# EAGLE board M8300B (EAGLE 6.6.0), part 1 of 3
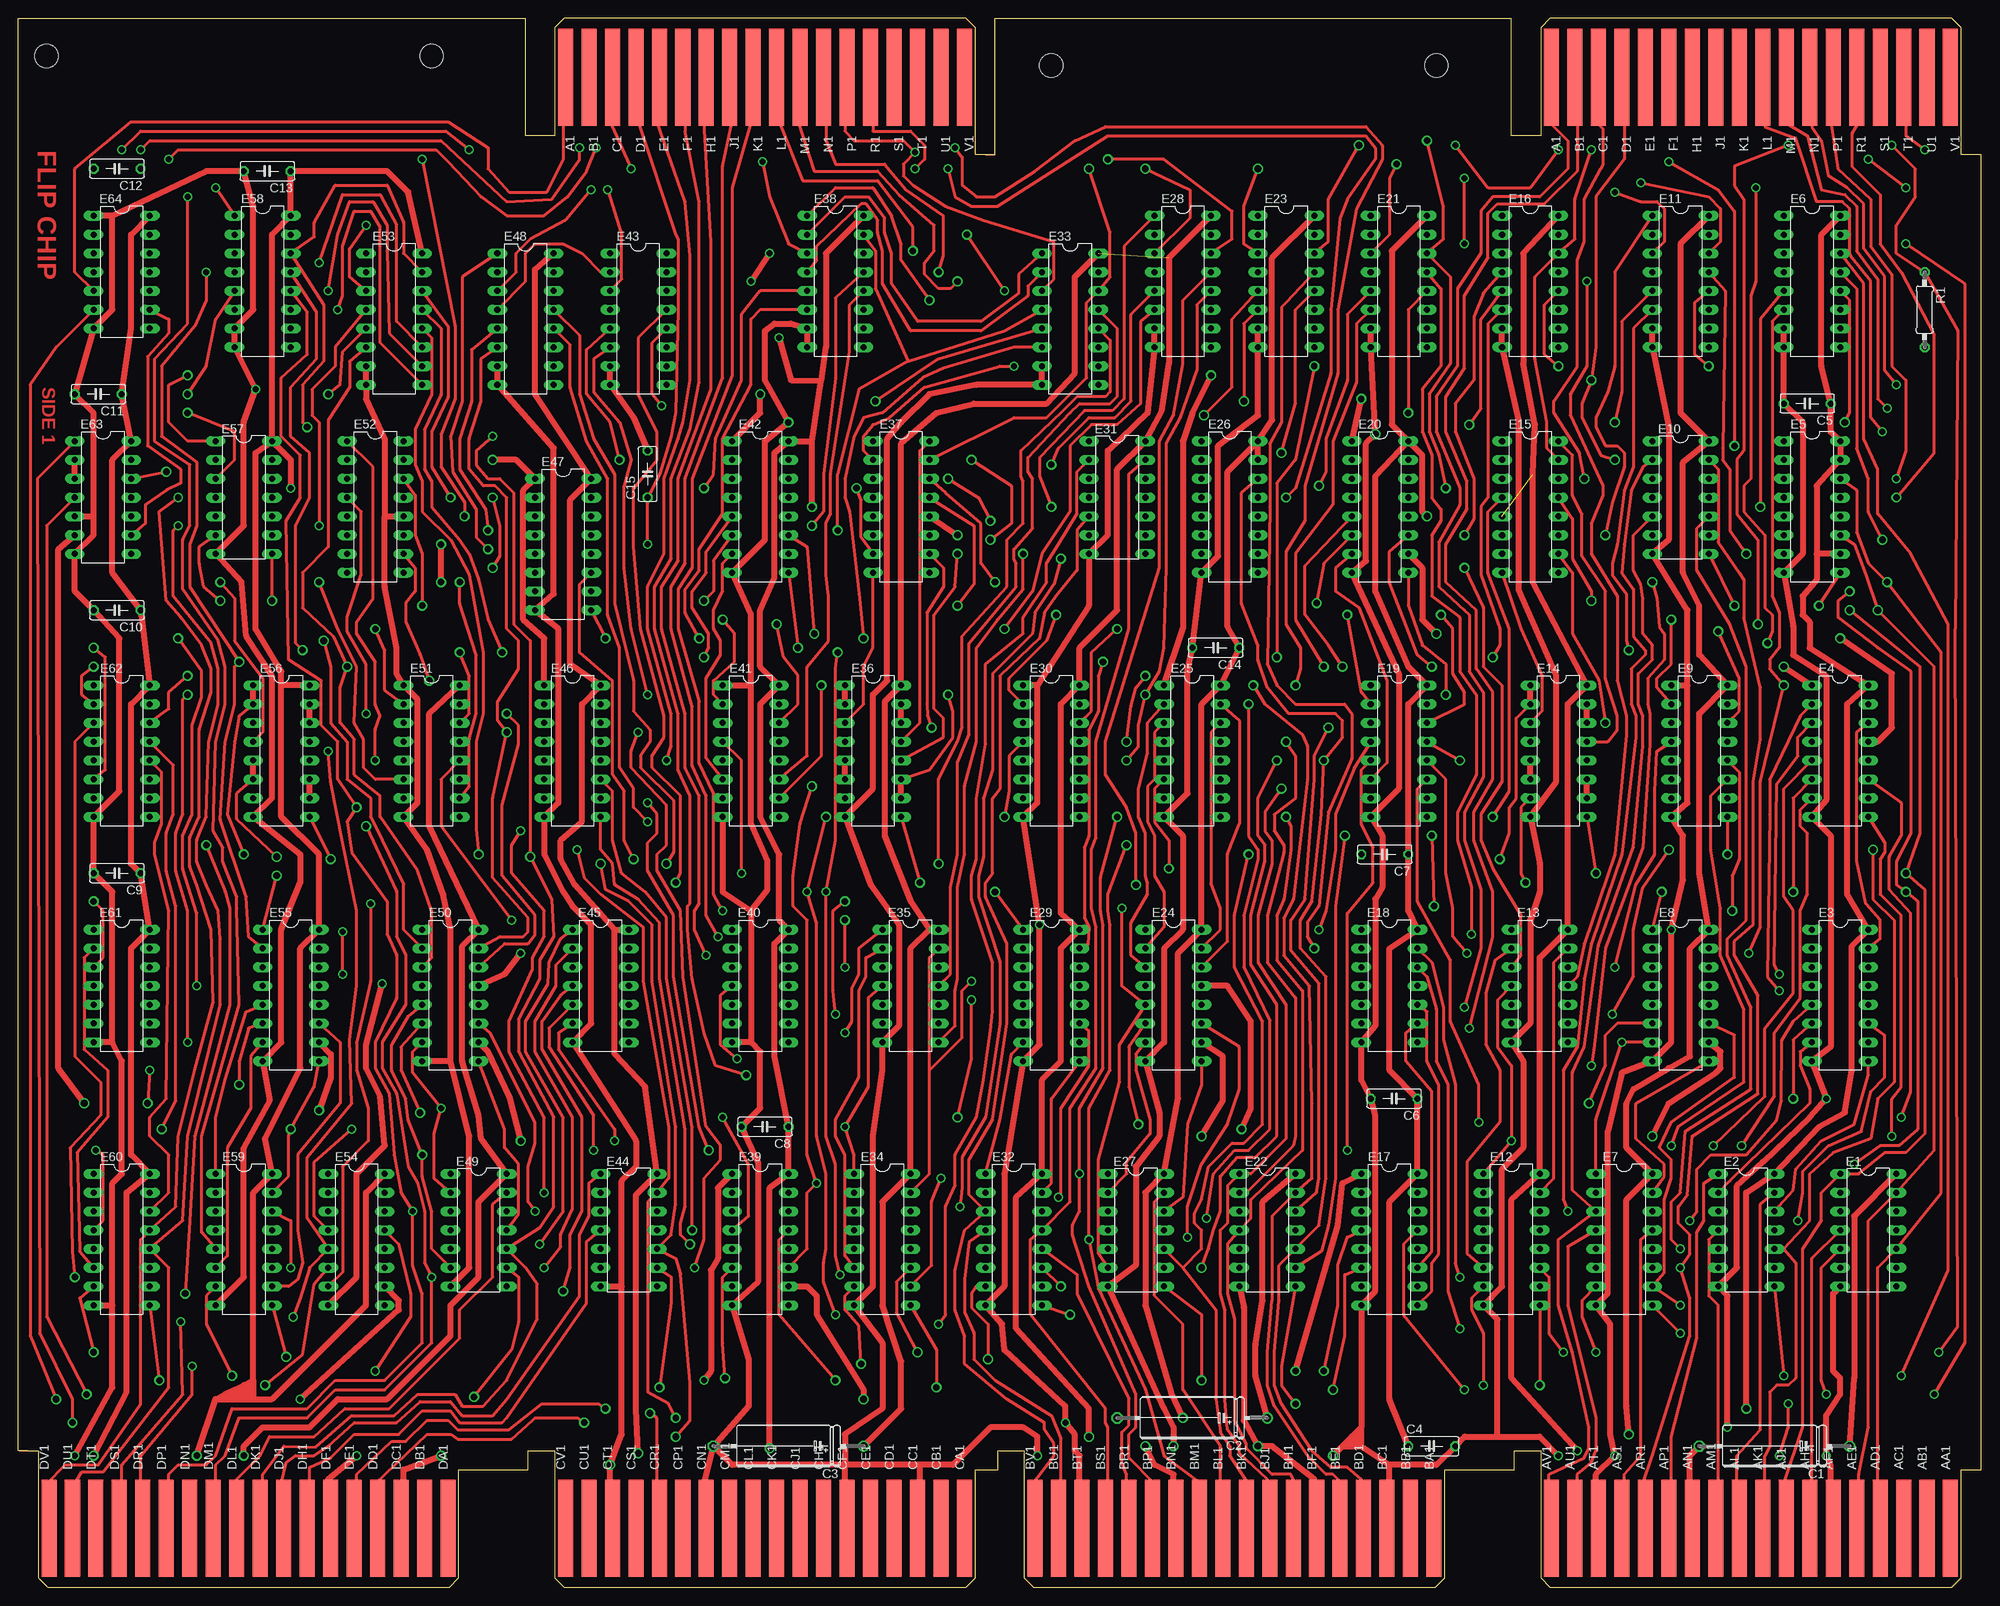
[diagram p3: board, top side]
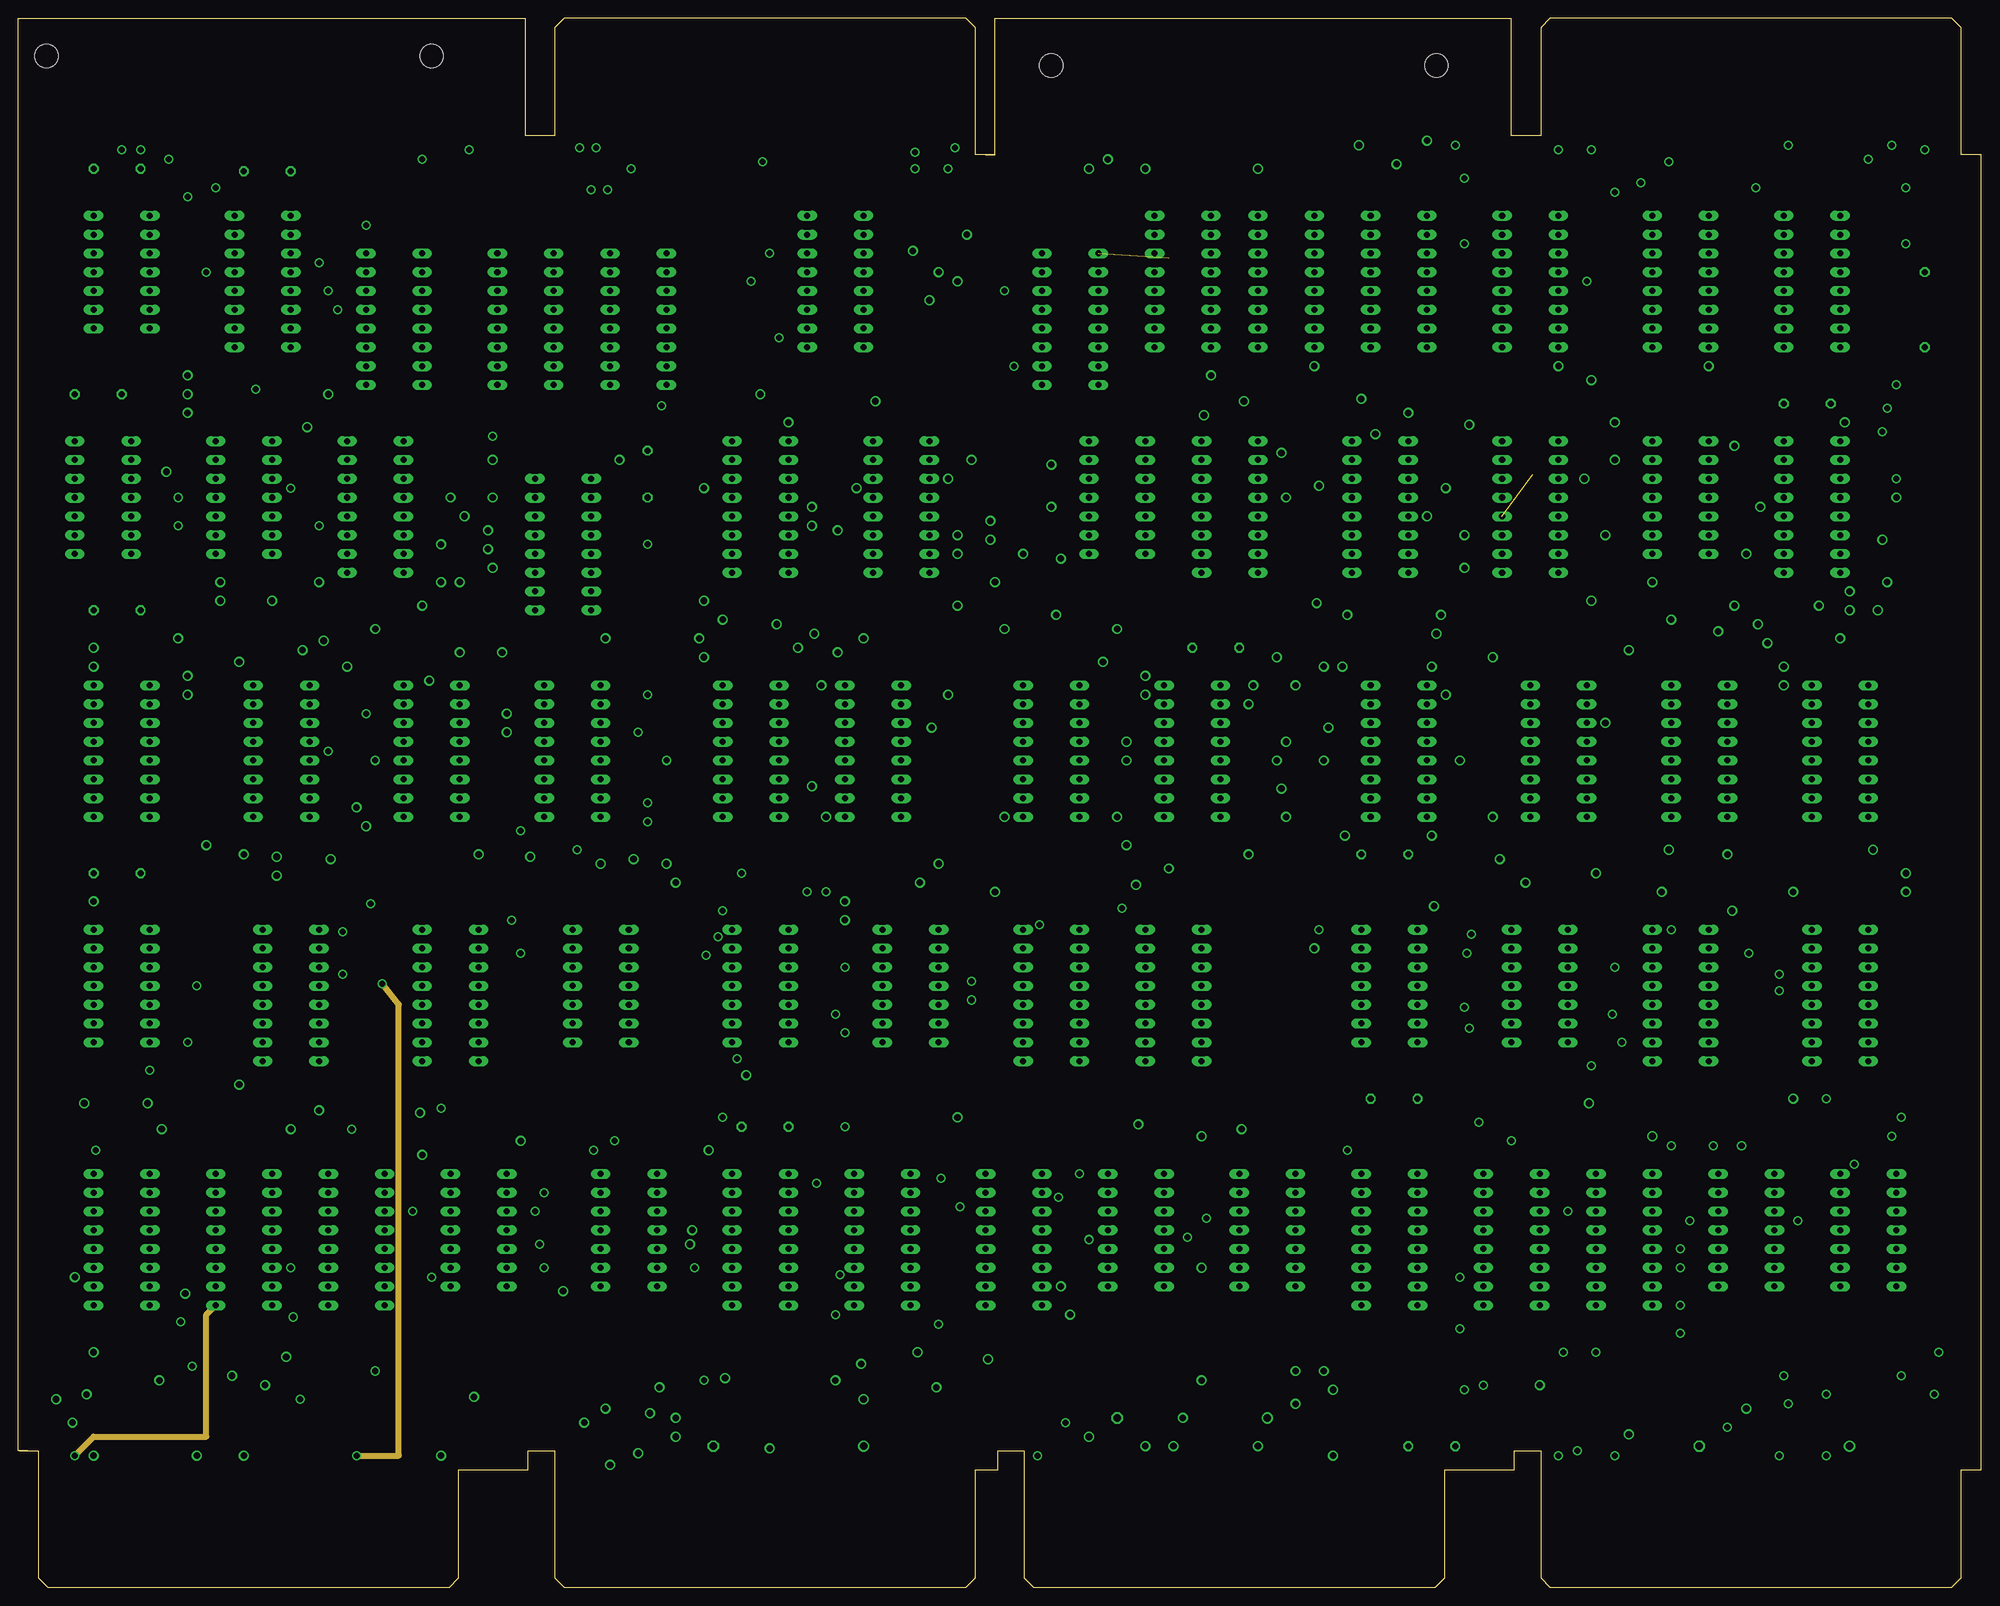
[diagram p4: board, inner layer Route2]
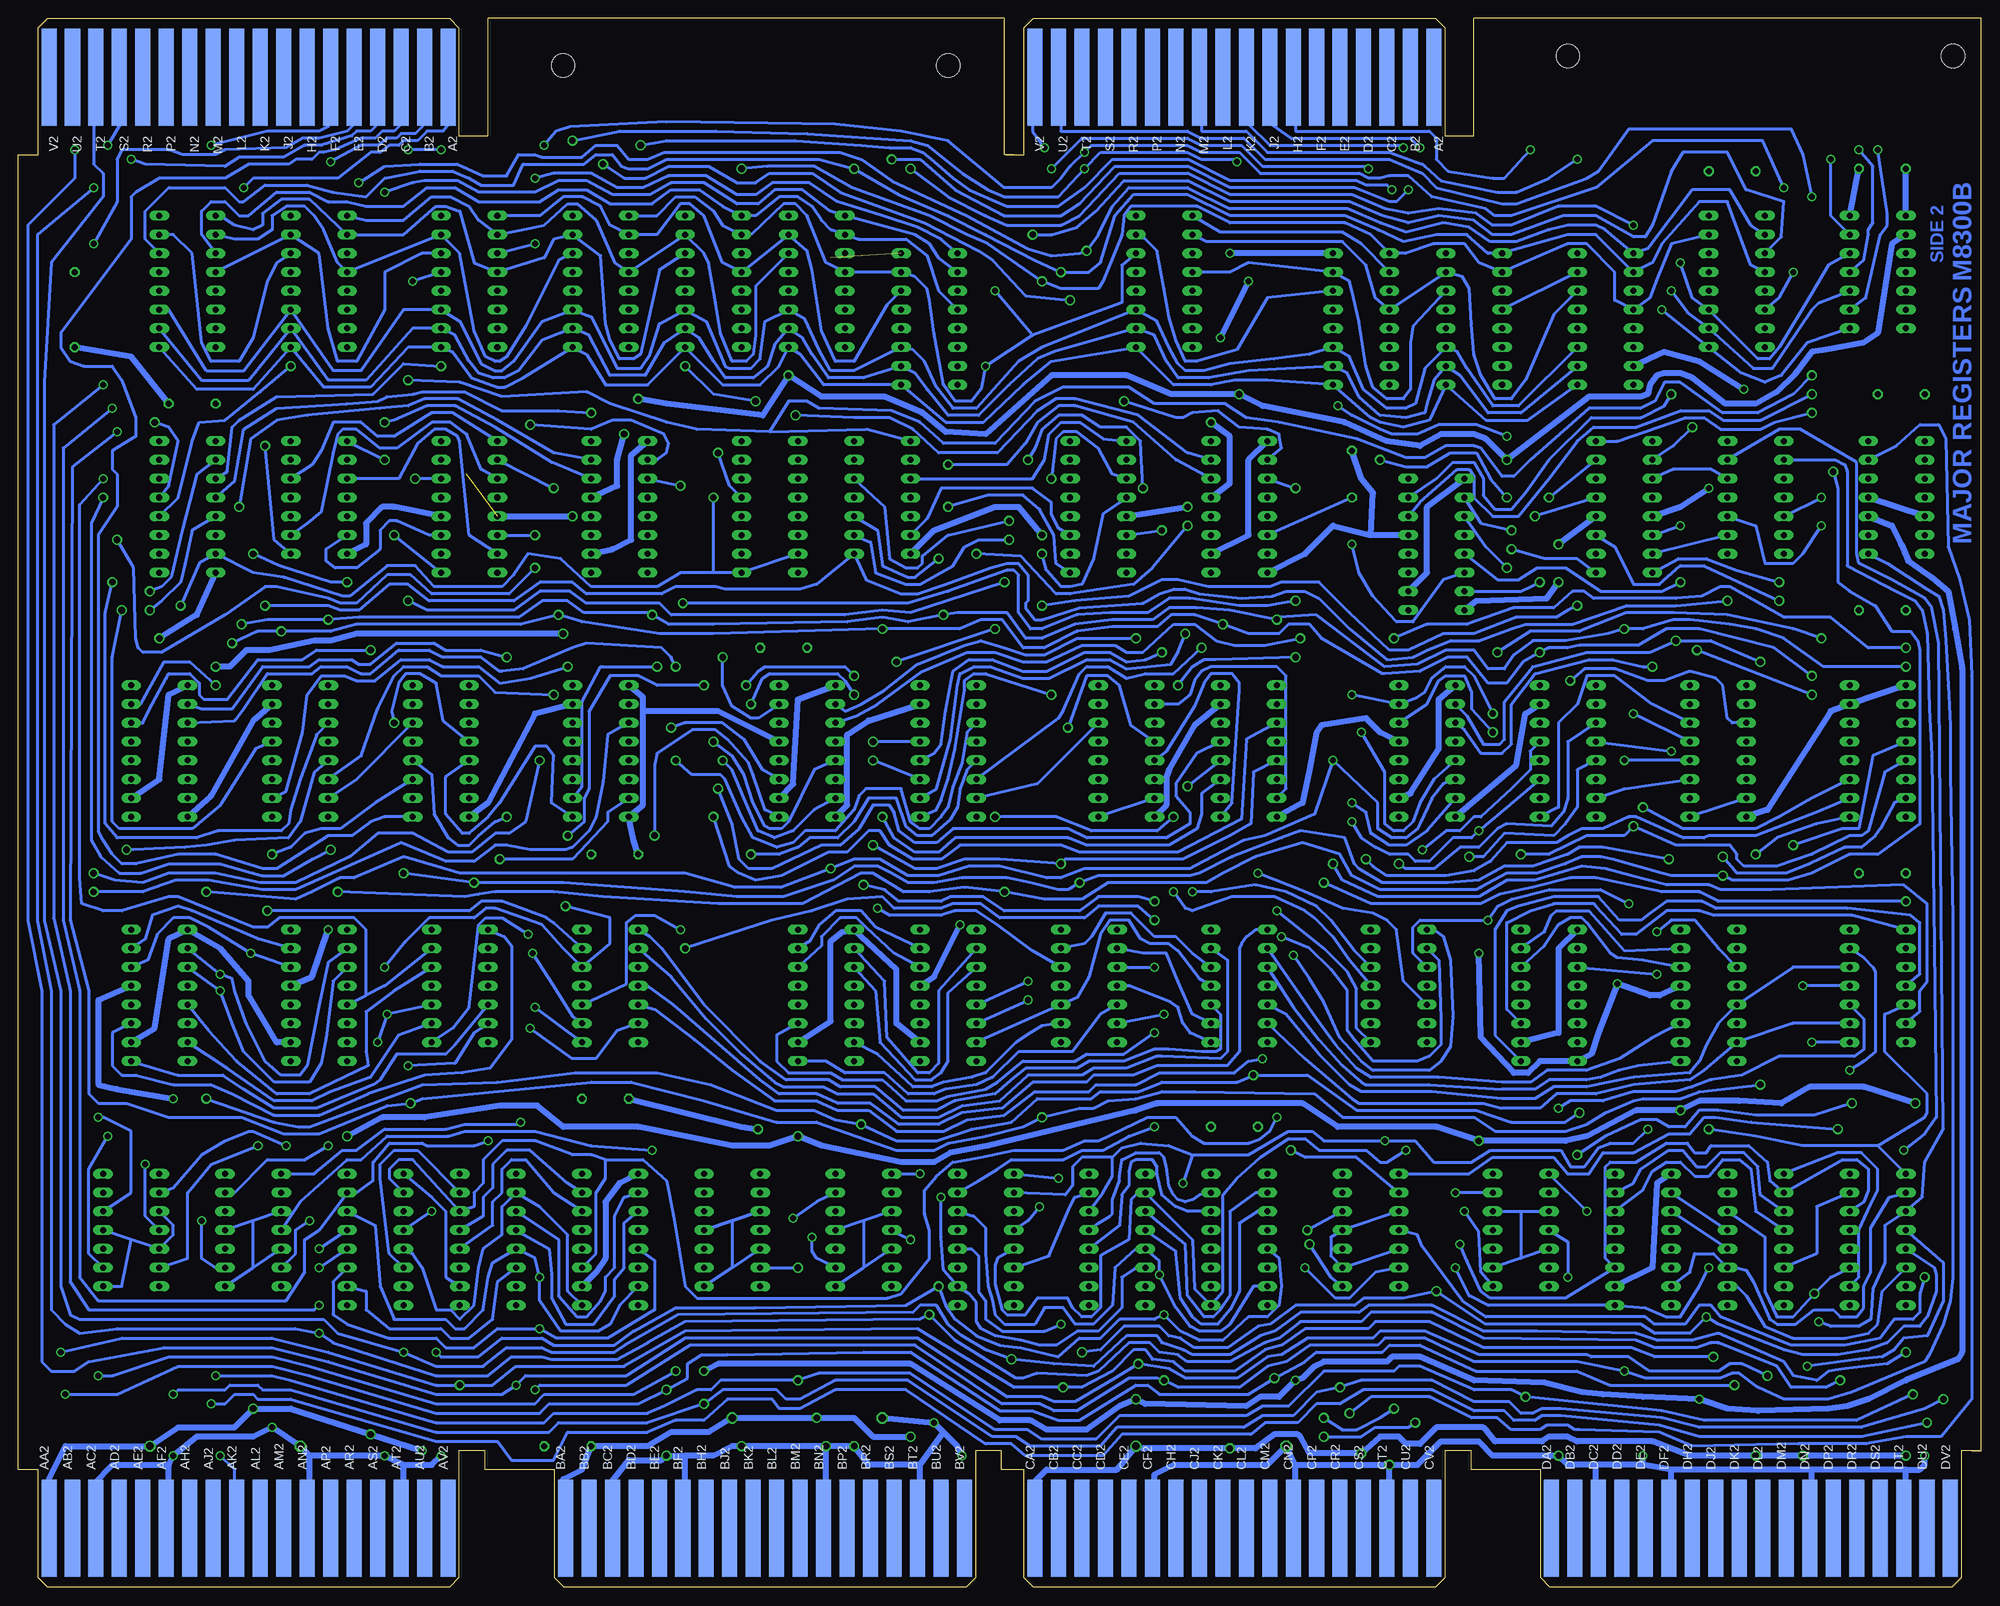
[diagram p5: board, bottom side, seen from below]

Size 265.43 x 212.09 mm. Coordinates in mm from the lower left corner, seen from the top.
Outline: 203.2,196.22 201.93,196.22 201.93,212.09 132.08,212.09 132.08,193.68 130.81,193.68
Outline: 1.27,18.41 0,18.41 0,212.09 68.58,212.09 68.58,196.22 69.85,196.22
Outline: 265.43,15.88 265.43,193.68 264.16,193.68
Copper layers (1+2+16): Top 0.035mm / dielectric 1.5mm / Route2 0.035mm / dielectric 0.15mm / Bottom 0.035mm
Design rules "16mils *": minimum track width 16mil, minimum drill 32mil, track to track 15mil, track to pad 10mil, pad to pad 10mil, via to via 10mil, smd to smd 10mil, copper to edge 13mil, drill to drill 10mil, minimum pad ring 10mil, minimum via ring 8mil, stop-mask expansion 0mil, vias tented up to drill 0mil, thermal gap 10mil
Net classes: 1 supply: width 0.813 mm
Holes 3.2 mm at 3.81,207.01 55.88,207.01 191.77,205.74 139.7,205.74

## Footprints (pad centres in the part's own frame; a part is rotated, then mirrored left to right if it is on the bottom)
E12-8 = drill 1.016: + -10.16,0 | drill 1.016 octagon: - 10.16,0
C063-025X075 = drill 0.813 octagon: 1 -2.54,0; 2 3.81,0
EDGE-CON2 = smd 13.106 x 2.032: A1 7.938,4.128; B1 7.938,7.303; C1 7.938,10.477; D1 7.938,13.652; E1 7.938,16.828; F1 7.938,20.003; H1 7.938,23.177; J1 7.938,26.352; K1 7.938,29.527; L1 7.938,32.703; M1 7.938,35.877; N1 7.938,39.053; P1 7.938,42.227; R1 7.938,45.403; S1 7.938,48.578; T1 7.938,51.752; U1 7.938,54.928; V1 7.938,58.102 | smd 13.106 x 2.032 bottom: A2 7.938,4.128; B2 7.938,7.303; C2 7.938,10.477; D2 7.938,13.652; E2 7.938,16.828; F2 7.938,20.003; H2 7.938,23.177; J2 7.938,26.352; K2 7.938,29.527; L2 7.938,32.703; M2 7.938,35.877; N2 7.938,39.053; P2 7.938,42.227; R2 7.938,45.403; S2 7.938,48.578; T2 7.938,51.752; U2 7.938,54.928; V2 7.938,58.102
DIL14 = drill 0.813 long: 1 -7.62,-3.81; 2 -5.08,-3.81; 3 -2.54,-3.81; 4 0,-3.81; 5 2.54,-3.81; 6 5.08,-3.81; 7 7.62,-3.81; 8 7.62,3.81; 9 5.08,3.81; 10 2.54,3.81; 11 0,3.81; 12 -2.54,3.81; 13 -5.08,3.81; 14 -7.62,3.81
DIL16 = drill 0.813 long: 1 -8.89,-3.81; 2 -6.35,-3.81; 3 -3.81,-3.81; 4 -1.27,-3.81; 5 1.27,-3.81; 6 3.81,-3.81; 7 6.35,-3.81; 8 8.89,-3.81; 9 8.89,3.81; 10 6.35,3.81; 11 3.81,3.81; 12 1.27,3.81; 13 -1.27,3.81; 14 -3.81,3.81; 15 -6.35,3.81; 16 -8.89,3.81
0207/10 = drill 0.813 octagon: 1 -5.08,0; 2 5.08,0
EDGE-CON8 = smd 2.032 x 13.106: AA1 261.303,7.938; AB1 258.127,7.938; AC1 254.952,7.938; AD1 251.778,7.938; AE1 248.602,7.938; AF1 245.428,7.938; AH1 242.252,7.938; AJ1 239.077,7.938; AK1 235.903,7.938; AL1 232.727,7.938; AM1 229.553,7.938; AN1 226.377,7.938; AP1 223.202,7.938; AR1 220.028,7.938; AS1 216.852,7.938; AT1 213.678,7.938; AU1 210.502,7.938; AV1 207.327,7.938; BA1 191.452,7.938; BB1 188.278,7.938; BC1 185.102,7.938; BD1 181.928,7.938; BE1 178.752,7.938; BF1 175.577,7.938; BH1 172.403,7.938; BJ1 169.227,7.938; BK1 166.053,7.938; BL1 162.877,7.938; BM1 159.702,7.938; BN1 156.528,7.938; BP1 153.352,7.938; BR1 150.178,7.938; BS1 147.002,7.938; BT1 143.827,7.938; BU1 140.653,7.938; BV1 137.477,7.938; CA1 127.953,7.938; CB1 124.778,7.938; CC1 121.603,7.938; CD1 118.427,7.938; CE1 115.252,7.938; CF1 112.078,7.938; CH1 108.903,7.938; CJ1 105.728,7.938; CK1 102.552,7.938; CL1 99.377,7.938; CM1 96.203,7.938; CN1 93.028,7.938; CP1 89.853,7.938; CR1 86.677,7.938; CS1 83.502,7.938; CT1 80.328,7.938; CU1 77.153,7.938; CV1 73.978,7.938; DA1 58.102,7.938; DB1 54.928,7.938; DC1 51.752,7.938; DD1 48.578,7.938; DE1 45.403,7.938; DF1 42.227,7.938; DH1 39.053,7.938; DJ1 35.877,7.938; DK1 32.703,7.938; DL1 29.527,7.938; DM1 26.352,7.938; DN1 23.177,7.938; DP1 20.003,7.938; DR1 16.828,7.938; DS1 13.652,7.938; DT1 10.477,7.938; DU1 7.303,7.938; DV1 4.128,7.938 | smd 2.032 x 13.106 bottom: AA2 261.303,7.938; AB2 258.127,7.938; AC2 254.952,7.938; AD2 251.778,7.938; AE2 248.602,7.938; AF2 245.428,7.938; AH2 242.252,7.938; AJ2 239.077,7.938; AK2 235.903,7.938; AL2 232.727,7.938; AM2 229.553,7.938; AN2 226.377,7.938; AP2 223.202,7.938; AR2 220.028,7.938; AS2 216.852,7.938; AT2 213.678,7.938; AU2 210.502,7.938; AV2 207.327,7.938; BA2 191.452,7.938; BB2 188.278,7.938; BC2 185.102,7.938; BD2 181.928,7.938; BE2 178.752,7.938; BF2 175.577,7.938; BH2 172.403,7.938; BJ2 169.227,7.938; BK2 166.053,7.938; BL2 162.877,7.938; BM2 159.702,7.938; BN2 156.528,7.938; BP2 153.352,7.938; BR2 150.178,7.938; BS2 147.002,7.938; BT2 143.827,7.938; BU2 140.653,7.938; BV2 137.477,7.938; CA2 127.953,7.938; CB2 124.778,7.938; CC2 121.603,7.938; CD2 118.427,7.938; CE2 115.252,7.938; CF2 112.078,7.938; CH2 108.903,7.938; CJ2 105.728,7.938; CK2 102.552,7.938; CL2 99.377,7.938; CM2 96.203,7.938; CN2 93.028,7.938; CP2 89.853,7.938; CR2 86.677,7.938; CS2 83.502,7.938; CT2 80.328,7.938; CU2 77.153,7.938; CV2 73.978,7.938; DA2 58.102,7.938; DB2 54.928,7.938; DC2 51.752,7.938; DD2 48.578,7.938; DE2 45.403,7.938; DF2 42.227,7.938; DH2 39.053,7.938; DJ2 35.877,7.938; DK2 32.703,7.938; DL2 29.527,7.938; DM2 26.352,7.938; DN2 23.177,7.938; DP2 20.003,7.938; DR2 16.828,7.938; DS2 13.652,7.938; DT2 10.477,7.938; DU2 7.303,7.938; DV2 4.128,7.938

## Placement (x,y rotation side)
C1  6.8uF  [E12-8]  237.49,19.05 180 top
C2  6.8uF  [E12-8]  158.75,22.86 180 top
C3  6.8uF  [E12-8]  104.14,19.05 180 top
C4  .22uF  [C063-025X075]  190.5,19.05 0 top
C5  .22uF  [C063-025X075]  242.57,160.02 180 top
C6  .22uF  [C063-025X075]  186.69,66.04 180 top
C7  .22uF  [C063-025X075]  185.42,99.06 180 top
C8  .22uF  [C063-025X075]  101.6,62.23 180 top
C9  .22uF  [C063-025X075]  13.97,96.52 180 top
C10  .22uF  [C063-025X075]  13.97,132.08 180 top
C11  .22uF  [C063-025X075]  11.43,161.29 180 top
C12  .22uF  [C063-025X075]  13.97,191.77 180 top
C13  .22uF  [C063-025X075]  34.29,191.45 180 top
C14  .22uF  [C063-025X075]  162.56,127 180 top
C15  100pF  [C063-025X075]  85.09,149.86 90 top
E  EDGE-TOP  [EDGE-CON2]  203.2,212.09 270 top
E1  N8881N  [DIL14]  250.19,48.26 270 top
E2  N8881N  [DIL14]  233.68,48.26 270 top
E3  DEC8271  [DIL16]  246.38,80.01 270 top
E4  DEC8271  [DIL16]  246.38,113.03 270 top
E5  MC8266  [DIL16]  242.57,146.05 270 top
E6  74151N  [DIL16]  242.57,176.53 270 top
E7  DEC8235  [DIL16]  217.17,46.99 270 top
E8  DEC8271  [DIL16]  224.79,80.01 270 top
E9  74153N  [DIL16]  227.33,113.03 270 top
E10  74H87  [DIL14]  224.79,147.32 270 top
E11  74151N  [DIL16]  224.79,176.53 270 top
E12  MC8266  [DIL16]  201.93,46.99 270 top
E13  7400N  [DIL14]  205.74,81.28 270 top
E14  MC8266  [DIL16]  208.28,113.03 270 top
E15  7483N  [DIL16]  204.47,146.05 270 top
E16  74151N  [DIL16]  204.47,176.53 270 top
E17  DEC8271  [DIL16]  185.42,46.99 270 top
E18  7420N  [DIL14]  185.42,81.28 270 top
E19  74153N  [DIL16]  186.69,113.03 270 top
E20  DEC8271  [DIL16]  184.15,146.05 270 top
E21  74151N  [DIL16]  186.69,176.53 270 top
E22  N8881N  [DIL14]  168.91,48.26 270 top
E23  74151N  [DIL16]  171.45,176.53 270 top
E24  DEC8271  [DIL16]  156.21,80.01 270 top
E25  DEC8271  [DIL16]  158.75,113.03 270 top
E26  MC8266  [DIL16]  163.83,146.05 270 top
E27  N8881N  [DIL14]  151.13,48.26 270 top
E28  74151N  [DIL16]  157.48,176.53 270 top
E29  DEC8271  [DIL16]  139.7,80.01 270 top
E30  74153N  [DIL16]  139.7,113.03 270 top
E31  74H87  [DIL14]  148.59,147.32 270 top
E32  DEC8235  [DIL16]  134.62,46.99 270 top
E33  74151N  [DIL16]  142.24,171.45 270 top
E34  MC8266  [DIL16]  116.84,46.99 270 top
E35  7400N  [DIL14]  120.65,81.28 270 top
E36  MC8266  [DIL16]  115.57,113.03 270 top
E37  7483N  [DIL16]  119.38,146.05 270 top
E38  74151N  [DIL16]  110.49,176.53 270 top
E39  DEC8271  [DIL16]  100.33,46.99 270 top
E40  7402N  [DIL14]  100.33,81.28 270 top
E41  74153N  [DIL16]  99.06,113.03 270 top
E42  DEC8271  [DIL16]  100.33,146.05 270 top
E43  74151N  [DIL16]  83.82,171.45 270 top
E44  N8881N  [DIL14]  82.55,48.26 270 top
E45  7430N  [DIL14]  78.74,81.28 270 top
E46  DEC8271  [DIL16]  74.93,113.03 270 top
E47  DEC8271  [DIL16]  73.66,140.97 270 top
E48  74151N  [DIL16]  68.58,171.45 270 top
E49  N8881N  [DIL14]  62.23,48.26 270 top
E50  DEC8271  [DIL16]  58.42,80.01 270 top
E51  74153N  [DIL16]  55.88,113.03 270 top
E52  7483N  [DIL16]  48.26,146.05 270 top
E53  74151N  [DIL16]  50.8,171.45 270 top
E54  DEC8271  [DIL16]  45.72,46.99 270 top
E55  DEC8271  [DIL16]  36.83,80.01 270 top
E56  MC8266  [DIL16]  35.56,113.03 270 top
E57  74H87  [DIL14]  30.48,147.32 270 top
E58  74151N  [DIL16]  33.02,176.53 270 top
E59  MC8266  [DIL16]  30.48,46.99 270 top
E60  DEC8235  [DIL16]  13.97,46.99 270 top
E61  7400N  [DIL14]  13.97,81.28 270 top
E62  74153N  [DIL16]  13.97,113.03 270 top
E63  74H04N  [DIL14]  11.43,147.32 270 top
E64  74H04N  [DIL14]  13.97,177.8 270 top
H  EDGE-TOP  [EDGE-CON2]  69.85,212.09 270 top
R1  470  [0207/10]  257.81,172.72 270 top
U$2  QUAD  [EDGE-CON8]  0,0 0 top

## Tracks (layer width: path | path; a pad name or v marks a point on that pad's centre or on a via)
!A00
  Top 0.406: E14.13 214.95,114.3 216.22,115.89 216.22,117.79 214.63,122.87 214.63,134.62 211.46,139.38 211.46,145.1 210.19,147.64 210.19,153.03 E15.16
!A01  (via drill 0.9)
  Top 0.406: v199.39,104.14 201.61,107.63 201.61,129.54 198.75,137.16 198.75,145.41 E15.4
  Bottom 0.406: E14.12 209.55,109.86 209.23,104.46 207.33,101.28 206.06,100.33 204.47,100.33 203.2,101.6 200.98,103.5 v199.39,104.14
!A02
  Top 0.406: E15.8 203.2,129.54 206.06,123.19 206.06,118.43 E14.3
!A03  (via drill 0.9)
  Top 0.406: E15.10 210.19,137.16 210.19,128.91 213.73,122.59 v214.63,116.84
  Bottom 0.406: E14.4 207.96,117.16 208.91,122.24 211.14,123.51 213.04,123.51 214,122.24 214.95,118.43 v214.63,116.84
!A04
  Top 0.406: E36.13 121.92,116.84 121.92,153.67 E37.16
!A05  (via drill 0.9)
  Top 0.406: E36.12 125.09,114.94 125.09,117.47 123.83,118.75 123.83,131.44 126.68,135.25 v127,139.7
  Bottom 0.406: E37.4 118.75,145.1 120.02,139.06 121.6,135.57 123.19,135.25 124.46,135.25 126.36,137.48 v127,139.7
!A06
  Top 0.406: E36.3 114.3,119.38 114.3,124.46 115.57,127 E37.8
!A07  (via drill 0.9)
  Top 0.406: E37.10 125.09,137.79 125.09,135.25 122.87,131.76 122.87,119.38 122.92,117.81 v123.51,116.2
  Bottom 0.406: E36.4 114.94,116.52 116.52,121.92 118.11,123.19 120.97,123.19 v123.51,116.2
!A08  (via drill 0.81)
  Top 0.406: v48.26,111.76 48.26,115.89 48.9,117.79 48.26,119.38 48.26,125.09 45.72,128.91 45.72,130.49 47.94,133.67 47.94,151.45 E52.1
  Bottom 0.406: E56.12 v48.26,111.76
!A09  (via drill 0.81)
  Top 0.406: v46.99,118.11 46.99,124.78 44.45,129.22 44.45,131.13 46.35,136.84 46.35,145.41 E52.4
  Bottom 0.406: E56.13 v46.99,118.11
!A10  (via drill 0.9)
  Top 0.406: v27.3,135.89 29.21,133.67 29.21,127.95 33.02,122.87 33.02,115.57 E56.4
  Bottom 0.406: E52.8 40.96,139.06 37.15,139.06 33.02,137.48 v27.3,135.89
!A11  (via drill 0.9)
  Top 0.406: E52.10 53.66,137.79 53.66,134.62 52.39,133.03 52.39,130.49 54.29,126.05 v55.56,122.56
  Bottom 0.406: E56.3 33.66,116.84 34.29,117.47 34.92,121.92 35.88,122.87 39.37,123.83 42.86,122.56 45.09,122.56 49.53,124.14 53.66,124.14 v55.56,122.56
!AC2BUS  (via drill 0.81, 0.9)
  Top 0.406: E60.7 8.26,39.05 v10.16,31.75 | E32.7 129.54,40.64 128.91,39.69 128.91,37.78 131.13,35.56 v131.13,30.8 | E7.7 211.46,38.73 211.46,36.51 v213.36,31.75
  Bottom 0.406: E.T2 255.27,200.66 255.27,192.41 254,191.13 254,187.96 260.99,179.07 261.94,162.88 261.94,90.17 259.71,80.64 259.71,40.64 258.44,36.83 257.18,36.2 224.16,36.2 222.25,34.29 v213.36,31.75 208.91,29.84 202.56,29.84 199.39,32.38 194.63,32.38 193.36,31.75 184.78,31.75 183.32,32.73 176.21,36.83 144.46,37.15 143.51,38.1 141.29,38.1 139.7,35.56 137.79,33.97 134.62,32.07 v131.13,30.8 125.41,30.16 120.02,29.84 115.57,33.97 111.44,33.97 110.81,33.02 107.95,32.07 106.68,31.43 101.6,31.43 97.47,33.97 95.57,34.61 92.08,37.15 84.14,37.15 82.87,38.1 74.3,38.1 67.31,34.61 60.01,34.61 46.67,34.29 43.81,33.34 39.05,33.34 35.56,34.29 26.67,30.48 25.4,28.57 22.23,27.94 20.64,29.21 18.41,29.53 12.7,30.16 v10.16,31.75
!AC04-11EQ0  (via drill 0.81)
  Top 0.406: v196.22,75.56 199.39,87.95 199.39,93.98 196.85,100.97 196.85,104.78 199.39,109.22 199.39,120.97 197.17,124.14 197.17,132.08 193.04,135.89 193.04,140.97 195.9,145.73 195.9,149.54 193.04,156.21 193.04,160.97 195.58,164.78 195.58,174.62 198.75,179.71 198.75,185.74 200.03,187.01 206.38,187.01 210.82,191.45 210.82,203.2 E.B1
  Bottom 0.406: E18.6 184.47,75.25 187.32,71.44 190.5,71.44 v196.22,75.56
!AC_LOAD  (via drill 0.81, 0.9)
  Top 0.406: E55.6 31.11,75.56 29.84,71.12 v29.84,67.94 | v127,63.5 128.91,71.44 v128.91,79.38 | v212.41,65.41 214.63,70.48 214.63,74.61 216.22,76.2 E8.6 | v252.09,156.21 250.51,158.12 250.51,176.53 247.97,179.71 247.65,180.34 247.65,186.37 246.7,187.32 243.21,187.32 240.35,195.9 236.22,197.49 236.22,203.2 E.L1
  Bottom 0.406: E29.6 v128.91,79.38 | v252.09,156.21 258.13,151.45 258.44,90.17 255.91,80.64 255.91,66.67 254.63,65.41 250.82,65.41 245.11,63.5 235.27,63.5 229.55,61.28 224.79,61.28 215.58,65.09 v212.41,65.41 210.82,66.04 187.96,68.26 182.56,68.26 172.72,65.72 162.88,62.87 157.48,62.87 146.69,59.05 141.6,59.05 139.7,60.01 134.62,60.96 129.54,62.23 v127,63.5 121.92,64.77 120.02,64.77 118.11,65.72 114.3,66.04 110.81,66.99 106.36,66.99 90.17,66.67 86.36,63.5 68.58,63.5 65.72,61.59 56.2,61.59 53.34,62.55 50.8,64.14 46.99,65.72 45.72,66.04 40.64,66.04 38.1,66.99 v29.84,67.94
!AD00  (via drill 0.81)
  Top 0.406: H.P1 111.76,201.93 111.76,196.85 113.03,195.58 119.7,195.58 v121.28,193.99 119.7,192.41 119.7,190.82 120.97,189.55 125.41,186.69 130.49,184.78 140.02,181.93 140.02,176.85 E33.3 | E58.1 v26.67,189.23 | v194.31,194.94 198.75,189.23 204.47,189.23 v208.28,194.31 | v212.72,194.31 210.5,187.64 210.5,182.25 E16.14 205.1,177.16 205.1,166.05 206.69,157.48 206.69,153.99 E15.15
  Bottom 0.406: E6.4 E11.15 224.79,180.34 223.52,170.18 222.25,165.74 219.71,165.74 215.9,172.72 215.9,177.8 210.82,180.34 E16.14 | v194.31,194.94 192.72,196.85 190.82,197.49 177.8,198.12 154.94,197.8 146.05,196.85 139.7,195.58 132.08,189.23 125.73,189.23 124.46,190.5 123.19,192.09 v121.28,193.99 120.33,194.94 107.31,194.94 105.41,193.99 100.33,193.99 97.47,191.13 84.14,191.13 82.87,190.5 81.28,190.5 80.01,190.82 77.47,190.82 74.3,187.96 66.99,186.37 65.72,185.42 63.5,185.42 52.07,189.23 44.45,195.58 29.53,195.58 v26.67,189.23 | v208.28,194.31 v212.72,194.31
!AD01  (via drill 0.81, 0.9)
  Top 0.406: H.R1 115.57,200.66 115.57,196.85 120.65,196.85 122.56,194.94 122.56,193.04 v121.28,191.77 | v100.65,192.72 101.6,187.96 104.14,181.61 E38.3 | v190.5,195.58 192.72,186.69 192.72,182.25 E21.14 193.68,177.16 193.68,165.42 190.82,161.29 190.82,156.21 192.09,153.03 v193.04,148.59
  Bottom 0.406: E6.2 236.22,182.25 233.04,182.25 231.14,183.51 231.14,185.42 229.24,186.69 226.69,186.69 225.43,185.42 224.16,183.51 222.25,179.07 E11.4 E16.15 205.74,180.34 203.84,169.86 202.25,166.37 200.98,165.74 200.34,165.74 199.39,166.37 196.85,170.5 192.41,179.39 E21.14 | v100.65,192.72 100.97,193.04 105.41,193.04 107.31,193.99 119.06,193.99 v121.28,191.77 124.78,187.96 132.08,187.96 134.3,188.91 137.79,191.13 142.56,194.94 144.78,195.58 158.75,196.53 171.13,196.85 184.15,196.85 v190.5,195.58 | E15.2 v193.04,148.59
!AD02  (via drill 0.81, 0.9)
  Top 0.406: E23.14 177.16,181.93 177.16,187.64 v181.29,194.94 | v79.69,188.91 81.6,182.88 81.6,176.85 E43.3 | E16.4 198.12,174.94 196.85,171.77 196.85,163.19 194.31,160.02 194.31,156.21 196.85,149.86 196.85,144.46 v195.58,142.24
  Bottom 0.406: E6.1 238.12,185.42 236.22,184.15 233.68,183.51 232.41,184.15 232.41,185.74 229.87,187.64 226.06,187.64 E11.2 213.36,182.88 208.91,186.69 207.65,186.69 205.74,186.06 203.84,179.07 E16.4 194.31,179.71 193.04,182.25 E21.15 186.69,180.02 186.06,170.81 185.42,168.59 184.15,166.05 182.25,166.05 181.29,166.69 178.75,178.12 E23.14 | E15.6 v195.58,142.24 | v79.69,188.91 80.33,189.55 83.19,189.55 84.45,190.18 101.6,190.18 107.31,193.04 117.47,193.04 121.28,189.23 124.78,186.69 131.76,186.69 136.84,188.91 139.06,190.5 141.6,192.72 143.19,193.99 144.78,194.63 147.64,194.63 151.45,194.94 160.34,195.58 177.8,195.58 v181.29,194.94
!AD03  (via drill 0.81, 0.9)
  Top 0.406: E28.14 164.15,182.25 164.15,186.06 154.94,193.04 v147.32,193.04 | v77.47,188.91 73.98,184.78 69.22,182.25 67.31,180.34 67.31,177.8 E48.3 | E11.1 215.9,177.8 215.9,165.1 214.95,161.61 213.36,158.12 213.36,156.84 214.63,154.31 216.22,154.31 217.17,153.35 217.17,151.45 215.58,146.69 v214.63,142.24
  Bottom 0.406: E11.1 218.44,184.78 213.36,184.78 209.55,187.96 207.01,187.96 204.47,186.69 203.2,184.78 E16.2 194.31,184.15 191.13,187.01 189.87,187.01 187.32,184.78 184.78,179.07 E21.4 E23.15 172.72,180.34 172.09,179.07 171.13,173.67 170.5,169.54 168.91,165.74 167,165.74 166.05,166.69 165.74,169.23 165.74,175.9 E28.14 | E15.9 v214.63,142.24 | v77.47,188.91 79.06,187.32 80.01,187.32 84.77,189.23 101.6,189.23 107.31,192.09 117.16,192.09 121.92,187.01 124.46,185.42 132.08,185.42 138.75,188.91 143.51,193.04 v147.32,193.04
!AD04  (via drill 0.81, 0.9)
  Top 0.406: E53.3 44.77,177.16 44.77,180.97 v46.99,184.15 | v144.78,191.77 147.64,183.2 147.64,177.16 E33.14 144.46,173.67 144.46,163.51 139.06,158.12 134.62,158.12 E37.15
  Bottom 0.406: E16.1 194.94,185.42 191.77,187.96 189.23,187.96 186.69,186.69 185.42,184.15 E21.2 179.07,182.88 175.9,187.01 174.62,187.01 172.72,185.42 170.18,179.07 E23.4 E28.15 158.75,180.66 158.12,178.12 156.84,169.86 154.94,165.74 152.4,165.74 147.96,173.35 E33.14 | v46.99,184.15 52.07,186.69 57.15,186.69 63.5,184.15 66.04,184.15 68.26,185.74 73.34,186.37 77.47,185.74 80.64,186.37 85.09,188.28 101.6,188.28 107.31,191.13 116.52,191.13 121.92,185.42 124.46,184.15 131.76,184.15 134.62,185.42 139.7,187.96 v144.78,191.77
!AD05  (via drill 0.81, 0.9)
  Top 0.406: v128.27,182.88 v133.35,175.26 | E37.2 114.3,153.67 114.3,155.57 115.57,157.16 117.79,158.12 122.56,162.24 132.72,165.1 v134.62,165.1
  Bottom 0.406: E21.1 179.07,185.42 176.53,187.96 173.99,187.96 171.45,186.06 170.18,184.15 E23.2 166.37,182.88 161.93,187.01 160.34,187.01 158.75,185.42 156.21,179.07 E28.4 E33.15 144.15,177.16 142.56,175.58 142.24,173.99 141.6,169.54 140.34,162.56 138.75,160.34 136.53,160.34 135.25,161.93 v134.62,165.1 128.27,169.23 | E58.3 26.99,182.56 26.67,187.32 31.75,188.91 34.29,193.99 40.32,193.99 41.91,191.45 44.45,184.15 45.4,182.56 46.99,182.56 52.07,185.42 56.52,185.42 63.5,182.88 66.04,182.88 68.58,184.78 73.34,185.42 77.47,184.47 80.96,185.42 85.41,187.32 101.6,187.32 107.31,190.18 115.89,190.18 119.7,186.06 122.24,183.83 125.73,182.88 v128.27,182.88 | E38.14 116.2,178.75 116.2,173.67 125.73,170.18 128.27,169.23 | 128.27,169.23 v133.35,175.26
!AD06  (via drill 0.9)
  Top 0.406: E38.15 115.89,180.66 115.89,175.58 120.33,165.74 | 120.33,165.74 133.35,169.86 E33.4 | 120.33,165.74 113.67,161.93 110.81,150.5 v110.81,142.88
  Bottom 0.406: E33.4 140.97,175.26 142.56,180.02 145.41,182.25 151.76,182.25 E28.2 155.57,183.51 156.84,184.78 158.12,186.69 160.02,187.96 162.56,187.96 165.74,185.42 E23.1 170.18,186.69 173.35,188.91 177.16,188.91 179.71,187.01 185.42,187.01 188.59,188.91 192.41,188.91 194.94,187.32 203.2,187.32 206.38,189.23 210.19,189.23 213.36,186.69 218.44,186.69 220.98,187.32 223.52,187.32 226.06,188.59 230.5,188.59 234.31,185.42 235.59,185.42 237.49,187.32 239.4,187.32 240.66,186.06 240.66,182.88 E6.3 | E43.14 96.52,174.31 100.65,167.32 106.05,165.74 107.63,165.74 108.9,168.59 109.86,171.77 110.49,175.58 111.44,180.66 113.03,182.25 E38.15 | E37.6 v110.81,142.88
!AD07  (via drill 0.81, 0.9)
  Top 0.406: E33.2 136.53,175.9 136.53,174.62 130.18,169.86 120.65,169.86 116.84,176.21 116.84,180.66 116.2,183.2 116.2,184.78 114.62,187.01 113.98,187.01 107.95,181.29 107.95,179.39 E38.4 | E28.1 149.54,181.29 149.54,160.66 147.96,159.07 144.15,159.07 138.11,152.72 138.11,150.18 v139.7,146.05 | v215.9,188.59 219.39,187.32 221.62,187.32 222.57,186.37 222.57,181.93 E11.3
  Bottom 0.406: v215.9,188.59 212.09,189.87 210.5,190.18 206.06,190.18 203.2,188.59 195.58,188.59 192.41,190.18 188.59,190.18 185.1,188.28 180.02,188.28 177.16,189.87 172.72,189.87 168.28,187.01 165.42,187.01 163.19,188.91 159.38,188.91 155.57,186.06 E28.1 144.15,182.88 142.24,181.61 140.97,179.71 E33.2 | E38.4 101.6,177.8 99.06,179.07 E43.15 85.41,176.53 85.09,175.26 84.14,171.13 83.19,165.1 82.23,162.24 80.33,160.66 78.11,160.66 77.15,161.93 77.15,168.28 76.83,170.5 E48.14 | E37.9 125.09,138.43 125.41,142.24 127.32,145.73 129.54,147.64 134.3,147.64 v139.7,146.05
!AD08  (via drill 0.81, 0.9)
  Top 0.406: E53.14 58.1,170.5 58.1,160.97 55.88,156.21 55.88,151.45 v58.42,147.32 | E33.1 135.25,177.48 135.25,174.94 130.18,171.13 121.6,171.13 118.11,176.21 118.11,180.34 117.16,183.2 117.16,185.1 114.94,187.96 111.76,187.96 E38.2 | v195.58,181.61 v195.58,190.5
  Bottom 0.406: E16.3 v195.58,181.61 | E38.2 104.78,181.93 86.36,181.93 83.19,178.75 81.92,174.31 E43.4 E48.15 70.17,177.16 69.22,175.58 68.9,170.81 68.58,166.69 67.63,163.83 65.72,160.66 63.5,160.66 61.59,163.19 57.78,172.09 E53.14 | E33.1 140.65,182.25 143.83,183.83 148.59,185.42 154.62,187.32 158.43,189.87 163.51,189.87 165.74,188.28 168.28,188.28 172.4,190.82 177.48,190.82 180.97,189.23 184.47,189.23 187.96,191.13 193.04,191.13 v195.58,190.5 | E52.15 v58.42,147.32
!AD09  (via drill 0.9)
  Top 0.406: v39.05,156.84 38.42,157.48 38.42,162.56 41.27,165.74 41.27,173.35 E58.14 40.01,182.56 40.01,184.47 42.86,189.55 49.85,189.55 52.07,184.47 52.07,180.34 E53.15 | E48.4 68.58,176.53 68.58,180.34 69.85,181.61 73.66,181.61 76.2,180.34 78.74,177.8 E43.2 | E38.1 110.49,189.23 115.57,189.23 118.11,185.42 119.38,181.61 119.38,179.39 v123.19,173.99 | v186.37,192.41 185.42,190.5 185.42,182.88 E21.3
  Bottom 0.406: E53.15 E48.4 | E43.2 83.82,181.61 86.36,183.2 102.87,183.2 E38.1 | E52.2 41.59,154.31 v39.05,156.84 | v186.37,192.41 183.51,190.5 180.66,190.5 177.48,192.09 172.09,192.09 168.28,189.87 165.74,189.87 163.83,191.13 158.12,191.13 154.31,188.59 142.88,184.47 135.57,180.66 133.67,179.39 129.22,174.62 v123.19,173.99
!AD10  (via drill 0.81, 0.9)
  Top 0.406: E53.4 42.86,167.64 42.86,165.1 39.69,161.93 39.69,158.43 40.64,157.48 v40.64,143.51 | H.M1 105.41,200.66 105.41,198.12 107.63,191.45 116.2,191.45 119.06,188.28 123.83,184.15 123.83,180.66 122.56,179.07 122.56,177.48 124.46,175.58 126.05,175.58 v127,176.53 | E23.3 165.74,181.61 165.74,186.69 v167.64,191.77
  Bottom 0.406: E52.6 v40.64,143.51 | E58.15 41.91,181.61 43.81,176.85 44.77,174.31 E53.4 49.53,173.99 49.53,177.8 53.34,181.61 55.88,181.61 E48.2 67.94,179.07 69.85,181.61 73.98,181.61 77.79,180.34 E43.1 82.55,182.88 86.04,184.47 101.6,184.47 106.05,186.69 114.94,186.69 115.89,185.42 116.2,182.88 118.75,176.53 119.38,175.58 124.46,175.58 v127,176.53 134.3,181.61 137.16,182.88 142.24,185.42 152.72,189.23 157.8,192.09 164.15,192.09 v167.64,191.77
!AD11  (via drill 0.81, 0.9)
  Top 0.406: E48.1 60.01,177.16 60.01,160.34 58.42,155.57 58.74,150.81 61.91,145.73 61.91,141.92 v63.5,140.34 | H.N1 109.22,203.2 109.22,195.58 110.49,192.41 117.16,192.41 120.02,188.91 125.09,185.42 125.09,180.02 v124.46,177.8 | v152.4,191.77 158.43,188.91 158.43,185.1 E28.3 | v176.53,29.21 178.44,38.1 178.44,43.5 179.71,47.31 E17.4 | v254.63,28.57 260.99,42.86 260.99,130.18 255.91,139.7 251.46,145.1 251.46,151.13 249.56,155.26 249.56,176.21 E6.14
  Bottom 0.406: E6.14 248.28,182.25 248.28,186.06 245.11,189.23 237.49,189.23 235.59,187.32 234.95,187.32 232.09,189.55 226.38,189.55 222.88,188.59 218.44,187.96 215.9,190.5 211.14,191.45 206.69,191.45 204.47,190.5 202.88,189.55 198.44,189.55 197.17,192.41 188.91,192.41 187.32,193.68 185.1,193.68 183.83,192.09 182.88,191.77 180.34,191.77 177.8,193.04 157.16,193.04 v152.4,191.77 146.37,188.28 139.7,185.42 134.62,182.88 127.95,179.39 v124.46,177.8 120.65,177.8 119.06,179.07 117.16,185.42 114.62,188.28 107.31,188.28 101.6,185.42 86.04,185.42 81.6,183.51 78.11,181.93 73.66,182.88 69.53,182.88 66.67,180.34 E48.1 55.88,182.88 52.07,182.88 E53.2 44.45,179.07 43.18,181.61 38.1,187.32 34.29,187.32 31.11,178.75 E58.4 | E52.9 54.61,139.06 59.05,139.06 v63.5,140.34 | v254.63,28.57 252.73,28.57 245.11,31.11 231.14,31.11 226.06,29.84 208.91,24.77 195.58,24.77 194.31,26.04 182.25,26.04 v176.53,29.21
!ADLK  (via drill 0.81, 0.9)
  Top 0.406: H.L1 102.87,200.66 102.87,198.12 106.05,190.18 116.2,190.18 120.97,183.83 v120.97,180.66 | v219.39,189.87 228.6,187.96 230.19,186.37 230.19,181.93 E11.14
  Bottom 0.406: E11.14 230.5,179.07 231.78,176.53 233.68,168.91 235.59,165.74 239.4,165.74 240.66,168.28 241.94,180.34 244.47,182.88 E6.15 | E58.2 31.11,184.15 33.97,188.91 39.05,188.91 45.09,180.97 E53.1 50.8,183.51 52.07,184.15 55.88,184.15 58.42,183.51 62.87,181.93 66.36,181.93 69.22,183.83 72.71,184.47 77.79,183.2 81.28,184.47 85.72,186.37 101.6,186.37 107.31,189.23 115.25,189.23 117.47,186.69 119.38,182.88 v120.97,180.66 121.92,180.34 125.73,180.02 128.91,180.97 137.16,185.42 147.32,190.18 151.45,193.04 154.31,193.99 178.12,193.99 180.34,193.04 182.88,193.04 184.47,194.94 187.32,194.94 189.23,193.36 194.63,193.36 195.58,193.68 197.8,193.68 199.39,190.82 202.56,190.82 206.06,192.41 211.14,192.41 215.9,192.09 218.44,190.5 v219.39,189.87
!AL2MQ_ENA  (via drill 0.81, 0.9)
  Top 0.406: E.T1 255.27,201.93 255.27,196.22 v257.81,194.31 | E59.7 25.4,39.37 25.4,35.56 v28.89,28.57 | v113.98,30.16 113.67,35.24 111.76,37.47 111.76,39.37 E34.7 | E12.7 196.53,39.05 196.53,37.47 198.12,34.29 v198.12,27.3
  Bottom 0.406: v257.81,194.31 257.81,190.5 264.16,184.15 264.16,90.17 262.25,80.64 262.25,30.48 260.99,29.21 257.81,29.21 255.91,30.48 245.75,32.38 231.14,32.38 223.52,30.48 208.91,26.04 200.03,26.04 v198.12,27.3 196.85,28.57 183.2,28.57 175.26,33.66 143.83,33.66 131.76,25.72 127,25.72 125.41,25.08 122.56,25.08 117.16,28.26 v113.98,30.16 109.86,29.53 107.63,28.26 100.65,28.26 96.52,31.11 94.61,31.43 91.12,33.66 82.23,33.66 81.28,34.61 75.25,34.61 67.94,31.43 53.34,31.43 52.7,31.11 47.62,31.11 44.77,29.21 35.56,29.21 33.97,30.16 32.38,30.16 v28.89,28.57
!AND00  (via drill 0.9)
  Top 0.406: E6.13 248.6,175.58 248.6,153.99 250.19,149.86 250.19,145.41 v252.09,141.6 | v195.58,137.79 198.12,132.4 198.12,124.46 200.66,121.92 200.66,108.9 197.8,104.46 197.8,100.97 199.39,97.16 203.2,90.81 203.2,85.41 E13.3
  Bottom 0.406: v195.58,137.79 199.07,134.3 209.55,134.3 212.41,136.84 215.58,136.84 219.71,133.03 221.93,133.03 223.52,133.67 230.5,135.25 232.09,135.25 237.49,131.44 246.06,126.36 248.6,126.36 249.24,127 249.56,128.27 249.87,137.79 v252.09,141.6
!AND01  (via drill 0.81, 0.9)
  Top 0.406: E11.13 230.82,175.26 230.5,153.99 230.5,152.4 231.46,151.13 231.46,142.88 v233.68,139.7 | v220.98,135.89 221.62,133.67 221.93,129.86 222.57,128.91 222.57,125.41 220.34,122.87 220.34,119.38 220.66,118.11 220.66,113.98 219.71,100.01 214.63,86.36 213.04,72.71 v212.72,70.48
  Bottom 0.406: E13.6 203.84,74.93 206.38,70.8 v212.72,70.48 | v220.98,135.89 223.2,135.89 230.19,138.11 v233.68,139.7
!AND02  (via drill 0.81)
  Top 0.406: v212.09,176.53 212.09,165.1 210.82,162.88 209.87,161.29 209.87,158.43 214.31,148.91 214.31,147.64 212.72,143.83 212.72,139.7 216.22,133.99 216.22,122.56 217.49,117.79 217.49,115.25 215.9,99.06 211.77,87 210.82,82.55 E13.11
  Bottom 0.406: E16.13 v212.09,176.53
!AND03  (via drill 0.81)
  Top 0.406: E21.13 192.41,175.58 192.41,165.1 189.87,161.93 189.87,156.21 191.13,153.03 191.13,147.32 192.41,145.73 192.41,144.15 191.13,142.24 191.13,133.99 194.94,131.13 194.94,123.83 197.17,120.65 197.17,109.86 194.63,104.78 194.63,100.97 196.53,94.61 v196.53,88.27
  Bottom 0.406: E13.8 206.69,75.56 204.47,78.42 203.2,89.53 202.25,90.49 200.03,90.49 v196.53,88.27
!AND04  (via drill 0.81, 0.9)
  Top 0.406: v111.76,83.82 v111.76,90.17 | E23.13 171.45,173.67 170.81,173.04 170.81,157.48 169.23,154.62 169.23,146.05 168.91,124.78 170.18,121.92 172.72,119.38 179.39,119.38 180.34,118.11 180.34,112.08 177.16,104.78 175.9,92.08 174.31,89.85 174.31,87.95 v175.26,86.36
  Bottom 0.406: E35.3 v111.76,83.82 | v111.76,90.17 113.98,92.08 119.38,92.08 121.28,90.49 132.72,90.49 135.25,92.39 139.06,92.39 140.65,91.76 147,91.76 148.59,93.34 153.35,93.03 158.12,91.44 163.51,90.17 v175.26,86.36
!AND05  (via drill 0.81, 0.9)
  Top 0.406: v110.49,77.47 110.17,80.64 110.17,91.44 v111.76,92.71 | v151.13,94.93 151.13,101.92 149.86,105.41 147,109.86 147,114.3 154.31,137.79 154.31,154.94 156.21,158.43 157.48,165.42 157.48,173.99 E28.13
  Bottom 0.406: E35.6 v110.49,77.47 | v111.76,92.71 113.98,93.34 119.38,93.34 121.92,91.44 132.08,91.44 134.94,93.34 139.38,93.34 140.65,92.71 146.37,92.71 148.27,94.3 v151.13,94.93
!AND06
  Top 0.406: E35.11 126.05,82.87 126.05,94.61 127,99.06 127,111.44 128.59,115.25 128.59,127.64 134.94,135.25 134.94,138.43 134.62,139.06 134.62,140.34 137.16,143.19 137.16,149.86 136.53,150.81 136.53,152.72 142.24,158.75 143.51,160.02 147.64,160.02 148.59,160.97 148.59,170.18 E33.13
!AND07  (via drill 0.9)
  Top 0.406: E38.13 110.49,174.31 110.49,163.51 108.9,150.5 108.9,145.41 v107.31,143.51 | E35.8 126.68,75.88 126.68,80.64 127,82.23 127,94.61 127.95,99.06 127.95,108.27 129.54,114.3 129.54,127 132.4,130.81 135.89,134.94 v135.89,139.7
  Bottom 0.406: v107.31,143.51 112.08,137.79 114.62,135.57 123.19,134.3 125.09,134.3 129.86,139.38 v135.89,139.7
!AND08  (via drill 0.9)
  Top 0.406: E61.3 11.43,85.09 11.43,91.44 v10.16,92.71 | v88.9,95.25 89.53,96.52 89.53,107 85.72,110.81 85.72,112.39 87.31,114.94 87.31,117.79 84.14,129.54 83.19,140.65 83.19,148.59 86.36,152.4 86.36,156.21 83.82,161.29 83.82,168.91 E43.13
  Bottom 0.406: v10.16,92.71 35.56,92.71 38.1,93.98 43.18,93.98 52.07,95.89 55.56,95.89 60.64,94.61 65.09,93.66 67.63,92.39 82.55,92.39 v88.9,95.25
!AND09  (via drill 0.9)
  Top 0.406: E48.13 75.88,169.23 75.88,161.29 77.79,155.26 80.64,150.5 80.64,133.03 83.19,122.56 83.19,118.43 85.41,115.89 85.41,114.3 84.14,112.39 84.14,110.81 88.58,106.36 88.58,99.38 v87.63,97.79
  Bottom 0.406: E61.6 8.26,77.79 8.26,80.64 7.3,81.92 7.3,92.39 10.48,94.93 28.26,94.3 35.24,94.3 36.83,94.93 42.55,94.93 47.31,96.2 50.8,97.16 53.98,97.47 60.33,95.57 64.14,95.57 67.94,93.34 81.6,93.34 86.36,95.57 v87.63,97.79
!AND10  (via drill 0.81, 0.9)
  Top 0.406: v24.13,81.28 24.13,91.12 22.23,97.16 22.23,101.6 23.5,104.46 23.5,116.52 24.77,120.33 24.77,123.83 v21.59,128.27 | E53.13 57.15,170.18 57.15,161.29 54.93,156.53 54.93,151.13 55.88,149.54 55.88,146.05 59.69,141.6 60.96,139.7 62.23,136.21 63.5,130.81 v65.41,126.36
  Bottom 0.406: E61.11 v24.13,81.28 | v21.59,128.27 25.4,129.54 34.29,131.44 41.59,131.76 47.94,131.76 54.29,129.22 60.96,129.22 v65.41,126.36
!AND11  (via drill 0.81, 0.9)
  Top 0.406: v22.86,73.66 22.86,91.44 21.27,96.84 21.27,101.92 22.23,104.46 22.23,120.02 v22.86,120.65 | v38.42,126.68 37.47,127.64 37.47,143.51 39.37,147.32 39.37,153.35 36.83,155.57 36.83,162.24 40.32,166.05 40.32,172.4 E58.13
  Bottom 0.406: E61.8 v22.86,73.66 | v22.86,120.65 v38.42,126.68
!B00
  Bottom 0.406: E15.1 204.15,157.16 206.69,158.75 209.55,158.75 214.63,155.57 216.85,155.57 219.07,157.48 222.88,157.48 224.47,153.67 225.74,151.76 E10.12
!B01
  Bottom 0.406: E15.3 202.88,151.13 204.79,155.89 207.01,157.48 209.55,157.48 214.31,153.99 216.53,153.99 219.71,156.53 221.62,156.53 222.25,155.89 222.88,153.35 224.47,145.41 226.38,143.83 E10.9
!B02
  Bottom 0.406: E15.7 204.47,142.24 205.74,154.94 206.06,155.57 207.65,156.53 209.23,156.53 211.46,154.62 214,149.86 E10.3
!B03
  Bottom 0.406: E15.11 209.87,142.24 214.31,144.15 215.26,144.15 216.53,142.88 216.53,140.34 219.71,137.79 222.57,137.79 223.84,138.75 223.84,140.34 E10.6
!B04
  Bottom 0.406: E31.3 128.27,149.86 126.68,152.4 126.05,155.89 124.46,157.48 121.92,157.48 118.75,155.26 E37.1
!B05  (via drill 0.9)
  Top 0.406: v125.73,149.86 129.86,147.32 v131.44,144.15
  Bottom 0.406: E31.12 148.27,146.05 147.64,139.06 145.41,137.79 143.83,137.79 143.19,138.43 143.19,139.38 139.7,142.24 v131.44,144.15 | E37.3 117.47,150.5 119.38,153.99 122.24,156.21 124.14,156.21 125.09,155.26 v125.73,149.86
!B06  (via drill 0.9)
  Top 0.406: E37.7 113.98,141.92 113.98,147 v113.35,148.59 | v128.91,152.4 134.3,148.91 134.3,143.83 v131.44,141.6
  Bottom 0.406: E31.9 150.18,141.29 149.54,137.16 145.41,135.57 143.51,135.57 139.06,138.11 137.48,140.65 135.57,141.6 v131.44,141.6 | v113.35,148.59 113.67,154.94 115.57,156.84 119.06,156.84 121.6,158.43 124.78,158.43 127,156.53 127.95,153.99 v128.91,152.4
!B07
  Bottom 0.406: E37.11 124.78,143.19 125.73,145.1 125.73,146.69 128.27,148.59 140.65,148.59 142.56,144.46 E31.6
!B08  (via drill 0.9)
  Top 0.406: E57.3 29.21,152.4 29.21,156.21 v22.86,158.75
  Bottom 0.406: E52.16 49.21,154.94 40.01,158.12 37.47,158.12 35.24,156.53 29.84,156.53 27.94,157.48 v22.86,158.75
!B09
  Bottom 0.406: E57.12 36.51,151.13 41.59,151.13 E52.3
!B10
  Bottom 0.406: E57.9 E52.7
!B11  (via drill 0.9)
  Top 0.406: v27.3,133.35 25.08,135.25 24.45,138.43 24.45,140.65 E57.6
  Bottom 0.406: E52.11 49.53,140.65 46.99,135.57 43.5,135.57 40.64,138.11 37.47,138.11 v27.3,133.35
!B_INIT  (via drill 0.9)
  Top 0.406: E63.12 v20,150.81 | E55.1 v34.92,96.2 | E29.1 v132.08,93.98 | E8.1 v222.25,93.98
  Bottom 0.406: v20,150.81 19.37,148.59 19.37,135.89 17.78,134.62 14.29,132.72 12.06,129.22 9.53,129.22 8.57,127.95 8.26,126.68 8.26,103.19 13.97,99.06 17.78,99.06 22.86,96.52 26.04,95.57 33.66,95.57 v34.92,96.2 41.91,96.2 43.18,96.52 49.85,98.42 51.44,98.74 53.98,98.74 56.2,97.79 60.01,96.52 64.14,96.52 67.63,94.61 68.26,94.3 81.28,94.3 85.09,96.2 86.68,99.06 91.76,100.65 98.11,98.74 102.55,96.52 104.78,95.25 118.11,95.25 121.6,93.03 126.68,93.03 v132.08,93.98 137.48,94.61 142.24,93.98 145.73,93.98 149.86,96.52 151.45,96.52 159.38,92.39 170.81,92.39 186.37,93.34 193.04,93.98 200.98,93.98 203.2,93.66 205.1,93.34 v222.25,93.98
!CARRY04  (via drill 0.9)
  Top 0.406: v132.08,135.89 130.18,138.43 130.18,143.83 125.41,147.96 E37.14 | E15.13 210.19,144.46 210.19,139.06 212.72,134.62 v212.72,133.35
  Bottom 0.406: v132.08,135.89 144.78,131.76 148.59,132.08 153.67,131.44 177.16,131.44 178.75,133.03 188.59,133.03 190.82,134.62 194.94,134.62 198.44,132.08 210.19,132.08 v212.72,133.35
!CARRY08  (via drill 0.9)
  Top 0.406: E52.14 53.66,147.64 53.66,142.24 54.61,139.7 v54.61,132.72 | E37.13 129.22,143.51 129.22,135.57 v127,132.72
  Bottom 0.406: v54.61,132.72 55.88,132.08 57.47,131.13 62.87,131.13 68.58,128.91 72.71,128.91 77.47,126.68 80.01,126.68 85.41,131.76 89.53,135.89 94.61,135.89 96.2,135.25 104.46,135.25 108.58,136.21 110.81,136.21 115.25,133.99 122.56,133.35 v127,132.72
!CARRY_IN  (via drill 0.81, 0.9)
  Top 0.406: v54.61,193.04 59.05,170.5 59.05,160.66 57.15,155.89 57.15,151.45 60.33,146.69 v60.33,144.78
  Bottom 0.406: H.M2 105.41,201.93 105.41,196.85 99.38,196.85 96.52,193.99 80.01,193.99 75.56,192.41 75.25,192.09 73.03,190.18 65.41,188.59 62.87,188.59 58.42,190.5 v54.61,193.04 | E52.13 v60.33,144.78
!CARRY_OUT  (via drill 0.9)
  Top 0.406: v211.77,149.86 211.14,153.35 207.65,158.75 207.65,160.34 210.82,165.1 210.82,179.39 211.77,181.93 211.77,187.64 214,191.77 214.31,192.41 214.31,197.17 213.36,198.12 213.36,203.2 E.C1
  Bottom 0.406: E15.14 v211.77,149.86
!CPMA_LOAD  (via drill 0.81, 0.9)
  Top 0.406: v87.63,111.76 88.27,113.67 88.27,118.11 85.09,129.54 85.09,135.25 87.31,139.7 87.31,149.86 89.22,155.26 89.85,157.48 90.81,163.19 90.81,180.02 90.17,187.32 86.36,198.12 86.36,203.2 H.E1 | E25.6 153.67,107.95 153.67,103.5 155.57,100.97 v155.57,97.16 | E4.6 240.03,106.68 v240.03,93.98
  Bottom 0.406: E46.6 72.71,108.58 74.3,106.68 75.88,103.19 76.2,102.55 77.79,101.28 79.69,101.28 81.6,102.55 81.6,106.05 v87.63,111.76 90.17,104.46 96.84,101.6 99.69,100.97 106.36,97.47 107,97.16 121.28,97.16 124.46,95.89 126.36,95.89 132.72,97.47 136.84,97.47 140.97,96.2 145.1,96.2 148.91,98.42 152.4,98.42 v155.57,97.16 162.24,94.61 168.59,94.61 175.26,96.52 205.74,96.52 208.91,97.47 213.36,98.74 220.03,95.89 221.93,95.89 225.74,93.98 227.97,93.03 v240.03,93.98
!LEFT  (via drill 0.81)
  Top 0.406: v16.51,194.31 17.78,195.58 57.15,195.58 66.04,187.32 72.07,187.64 75.88,193.04 v75.88,194.63
  Bottom 0.406: H.J2 96.52,200.66 96.52,198.12 93.34,195.9 77.15,195.9 v75.88,194.63 | E64.11 15.88,179.39 15.24,182.88 15.24,183.51 14.61,184.47 14.61,192.09 v16.51,194.31
!MA00  (via drill 0.9)
  Top 0.406: E5.14 248.6,148.27 248.6,142.56 250.19,138.43 v252.73,135.89 260.03,126.36 260.03,53.34 E1.10 251.46,43.18 251.46,8.89 U$2.AD1
  Bottom 0.406: E9.3 225.11,115.25 227.33,109.22 228.6,105.09 228.92,103.19 229.87,102.23 238.44,102.23 241.3,101.28 252.09,101.28 253.68,103.19 253.68,131.76 v252.73,135.89
!MA01  (via drill 0.9)
  Top 0.406: E5.11 248.28,140.97 249.87,136.84 v251.46,132.08 259.08,124.46 259.08,59.05 E1.13 250.19,49.53 250.19,21.59 248.92,15.24 248.92,8.89 U$2.AE1
  Bottom 0.406: E9.13 233.36,113.35 235.9,109.22 238.12,105.73 241.94,102.55 251.78,102.55 252.73,103.5 252.73,125.73 v251.46,132.08
!MA02  (via drill 0.81, 0.9)
  Top 0.406: v248.28,57.15 251.78,59.69 254.32,59.69 256.86,61.91 256.86,92.71 v255.27,93.98 254,94.93 254,98.11 255.91,101.92 255.91,123.83 251.46,127 246.06,131.13 246.06,133.35 v247.65,134.62 | U$2.AH1 242.57,8.89 242.57,44.45 E1.4
  Bottom 0.406: E1.4 248.28,50.16 v248.28,57.15 | E19.3 185.74,115.25 186.37,108.9 187.32,104.14 188.28,102.23 190.5,100.01 191.45,99.69 196.22,99.69 199.39,100.33 200.98,100.33 203.84,98.11 207.65,98.11 213.68,100.65 227.97,94.3 232.41,94.3 239.71,95.57 244.16,95.57 248.6,93.98 v255.27,93.98 | E5.2 241.3,150.5 243.21,143.19 244.79,136.53 246.06,135.25 v247.65,134.62
!MA03  (via drill 0.9)
  Top 0.406: E19.13 v194.94,111.76 | v247.65,132.08 257.18,124.46 257.18,101.92 v255.27,96.52 257.81,94.3 257.81,61.28 255.27,58.74 252.41,58.74 248.92,55.88 E1.1 243.84,53.34 243.84,49.53 241.3,45.72 241.3,21.59 238.76,13.97 238.76,8.89 U$2.AJ1
  Bottom 0.406: E5.5 241.94,142.88 242.89,138.43 243.52,135.89 246.06,133.35 v247.65,132.08 | v194.94,111.76 196.85,103.5 199.07,101.92 200.98,101.92 204.15,99.38 207.33,99.38 212.09,101.92 216.85,101.92 220.66,98.74 227.97,95.25 232.73,95.25 238.76,96.52 245.11,96.52 248.6,95.25 252.41,95.57 v255.27,96.52
!MA04  (via drill 0.9)
  Top 0.406: U$2.BD1 181.61,8.89 181.61,14.61 179.71,16.19 177.48,16.19 174.94,18.41 170.81,24.77 169.86,27.3 169.86,31.75 170.5,38.73 170.5,43.5 E22.10 175.9,48.9 176.85,55.24 176.85,82.55 173.35,86.36 173.35,90.17 174.94,92.71 176.21,104.46 v176.53,111.76 179.07,114.94 179.07,117.16 178.12,118.11 171.77,118.11 168.91,121.6 167.64,125.41 167.64,127.32 165.42,133.03 165.42,147.96 E26.14
  Bottom 0.406: E30.3 137.16,115.57 137.79,111.44 139.06,108.27 139.7,105.41 140.65,104.14 142.24,102.55 143.51,102.55 144.78,103.5 146.05,107.95 150.81,107.95 151.76,107 152.4,105.09 154.94,102.23 159.07,102.23 160.66,100.65 162.88,100.01 166.05,101.28 167.64,104.14 169.86,109.22 170.5,109.86 174.31,109.86 v176.53,111.76
!MA05  (via drill 0.9)
  Top 0.406: U$2.BE1 179.07,8.89 179.07,13.97 177.8,15.24 176.85,15.24 174.31,17.78 169.86,24.45 168.91,27.3 168.91,31.75 169.54,38.73 169.54,50.16 E22.13 174.94,55.24 174.94,65.41 174.62,81.28 171.13,85.41 171.13,90.49 172.4,93.03 174.31,109.22 174.31,113.67 173.67,115.25 168.59,119.38 v167,121.92 | v149.86,114.3 150.5,119.06 151.13,121.6 v152.4,123.19
  Bottom 0.406: E30.13 v149.86,114.3 | v167,121.92 165.42,123.83 164.47,124.46 153.67,124.46 v152.4,123.19
!MA06  (via drill 0.9)
  Top 0.406: U$2.BH1 172.72,8.89 172.72,13.97 172.09,15.24 169.54,15.24 166.05,18.73 166.05,19.37 164.47,22.54 164.47,36.2 163.51,39.69 163.51,46.35 E22.4 166.69,49.85 166.69,52.39 173.67,59.05 173.67,80.64 170.18,84.77 170.18,90.81 171.13,93.03 172.09,99.69 172.09,102.87 v171.45,104.14
  Bottom 0.406: E41.3 99.38,114.62 100.01,103.82 108.58,99.38 121.92,99.38 124.46,100.33 138.11,100.33 139.7,99.06 140.65,98.42 144.46,98.42 147.64,100.33 148.91,102.23 150.5,102.23 153.35,99.38 155.89,99.38 162.24,96.2 165.74,95.57 167.96,96.52 169.23,97.47 v171.45,104.14
!MA07  (via drill 0.9)
  Top 0.406: U$2.BJ1 168.91,8.89 168.91,14.61 165.1,18.1 165.1,19.05 163.51,21.27 163.19,25.4 163.19,37.47 162.56,39.69 162.56,48.26 163.51,49.21 163.51,54.29 E22.1 166.69,55.88 171.45,60.64 171.45,78.74 167.64,84.45 167.64,90.81 169.54,97.79 169.54,100.97 168.59,102.23 168.59,104.78 v170.81,107.95
  Bottom 0.406: E41.13 106.05,112.71 108.9,108.58 108.9,107 107,104.78 107,103.19 110.17,101.28 120.97,101.28 123.51,102.55 139.06,102.55 141.29,100.65 144.15,100.65 146.37,102.23 147,104.78 147.64,105.73 149.86,105.73 151.76,102.55 154.31,100.33 156.84,100.33 163.51,97.16 166.69,97.16 167.96,98.42 168.91,103.19 v170.81,107.95
!MA08  (via drill 0.9)
  Top 0.406: U$2.DD1 48.26,8.89 48.26,13.97 55.24,20.64 58.42,20.64 59.37,20 66.67,20 69.53,22.54 69.85,22.86 75.56,22.86 v76.52,22.23 | v88.9,20.32 90.81,22.54 90.81,27.62 89.53,42.23 88.9,44.45 E44.10 88.27,47.62 88.9,51.75 88.9,62.23 85.72,81.92 85.72,89.53 82.55,92.71 79.38,94.3 v78.74,97.79
  Bottom 0.406: E51.3 55.88,114.3 55.88,106.68 56.52,104.78 58.1,102.87 64.14,103.19 65.41,102.55 67.94,100.01 70.48,100.01 73.98,97.16 77.79,97.16 v78.74,97.79 | v88.9,20.32 83.82,20.32 81.92,21.59 77.47,21.59 v76.52,22.23
!MA09  (via drill 0.81, 0.9)
  Top 0.406: U$2.DE1 45.72,8.89 45.72,15.24 50.48,19.68 52.39,19.68 55.24,22.54 58.1,22.54 59.37,21.27 66.36,21.27 70.8,24.77 78.42,24.77 v79.38,24.13 | v88.9,22.86 87.95,24.77 85.09,26.35 85.09,52.07 E44.13 87.95,55.24 87.95,62.23 84.45,81.92 84.45,89.22 78.74,93.66 76.52,95.89 v75.56,99.69
  Bottom 0.406: E51.13 60.96,113.03 60.96,110.49 63.5,107.95 67.63,104.14 68.58,104.14 70.48,102.23 72.39,102.23 v75.56,99.69 | v88.9,22.86 86.36,21.27 84.45,21.27 81.28,22.86 v79.38,24.13
!MA10  (via drill 0.9)
  Top 0.406: E62.3 7.62,114.3 7.62,71.75 11.11,68.26 11.11,63.82 6.99,59.37 7.3,45.4 v7.62,41.91 | U$2.DH1 39.37,8.89 39.37,16.19 42.23,17.46 45.4,20.64 51.44,20.64 54.61,23.81 58.42,23.81 59.69,22.23 65.41,22.23 66.04,22.86 76.83,38.42 76.83,46.67 E44.4
  Bottom 0.406: v7.62,41.91 8.26,39.69 8.26,37.15 9.21,36.2 11.75,36.2 13.65,33.66 18.41,32.7 25.72,32.7 35.24,36.51 36.51,38.1 38.1,38.1 39.69,35.88 40.01,35.56 44.13,35.56 45.4,36.51 66.99,36.51 70.17,38.73 75.56,46.04 76.2,47.62 E44.4
!MA11  (via drill 0.9)
  Top 0.406: E62.13 20.95,111.12 20.95,104.46 20,101.92 20,96.84 21.27,92.08 21.27,65.72 v19.37,61.91 | U$2.DJ1 35.56,8.89 35.56,13.97 36.2,16.83 37.47,17.78 40.01,17.78 41.91,19.05 45.4,22.23 51.12,22.23 54.29,25.08 58.42,25.08 60.01,23.18 64.14,23.18 66.04,25.4 75.88,39.37 75.88,47.62 77.15,50.16 77.15,54.61 E44.1
  Bottom 0.406: E44.1 69.22,55.88 66.04,58.1 57.78,58.1 55.88,55.88 53.02,55.88 51.12,58.74 46.99,58.74 42.23,61.28 39.37,61.28 37.47,63.5 35.88,63.5 31.11,62.87 v19.37,61.91
!MAC
  Top 0.406: E64.5 7.62,177.8 7.62,191.77 15.24,198.12 58.1,198.12 63.5,194.63 63.5,191.77 66.36,188.59 71.44,188.59 73.66,193.04 73.66,203.2 H.A1
!MB_LOAD  (via drill 0.9)
  Top 0.406: E50.6 51.75,73.03 51.75,69.85 v54.29,64.14 | v98.42,69.22 94.3,70.48 92.71,74.93 91.12,82.23 90.49,88.9 90.49,92.08 90.81,92.39 90.81,107 89.22,110.49 89.22,118.11 86.04,129.54 86.04,135.25 88.27,139.06 88.27,149.86 90.81,156.53 92.08,162.88 92.08,187.32 90.17,196.85 90.17,203.2 H.F1 | E24.6 150.18,73.03 150.18,67.63 v151.45,62.55 | E3.6 240.03,73.98 v240.03,66.04
  Bottom 0.406: v240.03,66.04 230.82,62.87 227.65,62.23 226.06,62.23 210.82,67.94 200.66,68.26 190.18,69.53 179.07,69.53 171.77,67.94 162.88,64.45 157.8,64.45 154.94,63.18 v151.45,62.55 146.69,60.33 141.29,60.33 136.53,61.91 131.13,62.87 127.64,66.04 120.33,66.04 119.06,66.99 113.98,66.99 110.81,68.26 100.65,68.26 v98.42,69.22 91.12,69.22 84.45,64.45 68.26,64.45 63.5,62.87 56.2,62.87 v54.29,64.14
!MD00  (via drill 0.9)
  Top 0.406: v250.82,99.69 250.82,93.03 253.68,90.17 253.68,68.26 251.46,66.04 250.51,60.64 245.43,58.74 242.25,55.88 242.25,49.53 238.76,45.72 | E2.10 238.76,45.72 | 238.76,45.72 240.35,43.81 240.35,28.26 239.4,27.3 237.81,27.3 236.85,26.35 236.85,19.05 236.22,17.78 236.22,8.89 U$2.AK1
  Bottom 0.406: E9.5 225.43,110.17 227.33,103.5 228.92,101.28 236.22,100.97 240.03,100.33 242.89,100.01 249.87,99.69 v250.82,99.69
!MD01  (via drill 0.81)
  Top 0.406: U$2.AL1 232.41,12.7 232.41,17.78 235.59,21.27 235.59,51.75 E2.13 | v223.52,59.69 224.47,62.23 233.36,68.26 233.36,78.11 230.19,85.41 230.19,91.76 228.92,99.69 228.92,107 E9.11
  Bottom 0.406: E2.13 236.22,53.34 231.78,57.78 226.69,57.78 v223.52,59.69
!MD02  (via drill 0.81)
  Top 0.406: v179.71,59.05 179.71,91.12 183.2,95.25 183.2,100.01 181.61,103.19 181.61,110.49 E19.5 | U$2.AM1 229.87,7.62 229.87,38.1 228.6,39.37 228.6,46.99 E2.4
  Bottom 0.406: E2.4 227.33,52.07 220.98,57.78 219.07,57.78 215.58,60.96 207.33,60.96 205.1,61.59 195.58,61.59 187.96,59.69 v179.71,59.05
!MD03  (via drill 0.81)
  Top 0.406: v197.49,62.87 197.49,67.94 193.68,76.52 193.68,84.77 189.23,92.71 189.23,107.95 E19.11 | U$2.AP1 223.52,8.89 223.52,20.32 227.01,33.66 227.01,47.94 227.97,49.53 227.97,54.61 E2.1
  Bottom 0.406: E2.1 225.43,55.88 221.62,59.05 219.71,59.05 215.9,61.91 207.65,61.91 205.1,62.55 197.8,62.55 v197.49,62.87
!MD04  (via drill 0.9)
  Top 0.406: U$2.BK1 166.37,8.89 166.37,13.97 163.83,17.78 163.83,19.05 162.56,20.95 161.93,25.4 161.93,37.47 157.48,43.18 | E27.10 157.48,43.18 | 157.48,43.18 160.02,45.72 160.02,48.26 159.07,49.21 159.07,50.48 160.02,52.39 160.97,56.83 164.15,60.01 165.74,60.01 168.28,62.55 168.28,76.52 164.47,83.82 164.47,90.81 v166.37,99.06
  Bottom 0.406: E30.5 137.16,110.49 138.11,107.95 138.43,105.41 139.38,103.82 141.92,101.6 143.83,101.6 145.41,102.87 146.69,106.68 150.5,106.68 152.4,103.5 154.62,101.28 158.43,101.28 160.02,100.01 162.56,99.06 v166.37,99.06
!MD05  (via drill 0.81, 0.9)
  Top 0.406: U$2.BL1 162.56,8.89 162.56,19.05 157.48,26.67 157.48,35.56 153.67,39.37 153.67,52.07 E27.13 | v160.66,49.85 161.61,55.88 164.47,59.05 166.37,59.05 169.23,61.91 169.23,76.52 165.74,83.82 165.74,90.81 167.64,98.42 167.64,99.69 166.37,101.6 v166.37,119.38 | v149.86,111.76 151.45,113.67 151.45,116.52 v152.4,120.65 154.31,123.83 154.94,127 155.26,137.79 155.26,154.62 157.16,158.12 159.38,164.47 159.38,173.35 E28.12
  Bottom 0.406: E27.13 157.48,52.07 v160.66,49.85 | E30.11 v149.86,111.76 | v166.37,119.38 164.78,122.87 163.83,123.51 154.62,123.51 153.67,122.56 v152.4,120.65
!MD06  (via drill 0.81, 0.9)
  Top 0.406: v124.46,97.79 124.46,109.22 127,114.3 127.64,116.2 127.64,128.59 133.67,135.25 133.67,141.6 135.89,143.83 135.89,149.54 135.57,150.18 135.57,153.67 141.29,159.07 143.19,160.97 147,160.97 147.64,161.61 147.64,168.59 E33.12 | U$2.BM1 160.02,8.89 160.02,13.97 154.94,17.78 152.4,26.67 146.05,40.32 v144.78,46.99 144.78,64.77 147.64,69.85 147.64,89.53 147.32,91.44 147.32,93.66 v149.86,100.33
  Bottom 0.406: E27.4 v144.78,46.99 | E41.5 98.42,110.17 98.74,103.19 101.6,101.6 107.95,98.42 123.83,98.42 v124.46,97.79 132.72,98.42 137.48,98.42 141.29,97.16 144.15,97.16 v149.86,100.33
!MD07  (via drill 0.81, 0.9)
  Top 0.406: E41.11 106.68,112.39 106.68,124.46 109.54,127.95 109.54,133.99 109.22,136.84 109.22,143.83 109.86,145.1 109.86,150.5 112.39,167 112.39,173.35 E38.12 | U$2.BP1 153.67,8.89 153.67,13.97 150.18,17.46 150.18,20.64 151.13,21.59 151.13,26.04 144.78,40.64 142.56,47.62 142.56,48.9 143.51,50.8 v143.51,55.88 143.51,64.77 146.69,70.17 146.69,89.53 146.37,91.44 146.37,95.89 v148.59,104.14
  Bottom 0.406: E27.1 v143.51,55.88 | E41.11 105.41,107.31 105.41,104.46 106.05,102.55 109.86,100.33 120.97,100.33 123.51,101.28 138.75,101.28 140.97,99.38 144.15,99.38 147,101.28 v148.59,104.14
!MD08  (via drill 0.81, 0.9)
  Top 0.406: U$2.DK1 33.02,10.16 33.02,15.24 35.88,19.05 40.17,18.91 45.09,23.18 50.8,23.18 53.98,26.04 59.05,26.04 60.01,24.45 62.87,24.45 66.04,27.94 70.17,36.2 70.17,40.96 68.58,43.18 E49.10 70.48,48.58 72.39,51.44 72.39,63.5 67.63,72.39 67.63,76.83 70.48,82.23 70.48,84.77 72.39,87.95 72.07,93.03 v69.22,98.74 69.22,127.95 66.99,130.18 66.99,147.96 65.09,149.86 63.5,149.86 61.91,151.76 61.91,153.67 v64.14,155.57 | v87,159.7 85.72,161.29 85.72,168.28 E43.12
  Bottom 0.406: E51.5 54.61,110.49 54.61,105.41 56.2,103.19 57.78,101.6 64.45,101.92 67.31,98.74 v69.22,98.74 | v64.14,155.57 68.26,157.16 73.34,157.16 76.2,155.89 79.69,155.89 81.28,156.53 85.09,158.43 v87,159.7
!MD09  (via drill 0.81)
  Top 0.406: U$2.DL1 29.21,8.89 29.21,14.29 32.7,17.78 33.97,20.32 40.01,20.32 44.13,24.13 50.16,24.13 59.69,33.66 59.69,37.47 64.14,41.91 64.14,51.75 E49.13 | v71.12,53.34 71.12,63.5 66.36,72.39 66.36,76.52 69.53,83.5 69.53,85.09 71.12,87.95 71.12,91.44 66.67,96.52 66.67,100.33 v67.94,102.23 | v85.09,103.5 83.19,105.41 83.19,107.95 81.28,110.81 81.28,127 79.69,131.44 79.69,149.86 76.83,154.94 74.61,162.24 74.61,167.96 E48.12
  Bottom 0.406: E51.11 64.14,105.41 v67.94,102.23 68.9,101.28 71.44,101.28 74.61,98.11 76.52,98.11 77.47,99.06 80.01,99.06 81.92,100.01 83.82,101.28 v85.09,103.5 | E49.13 v71.12,53.34
!MD10  (via drill 0.81, 0.9)
  Top 0.406: E53.12 55.88,168.91 55.88,161.29 53.66,156.53 53.66,151.76 54.61,149.54 54.61,145.41 58.42,141.6 60.96,136.84 62.87,126.36 62.87,118.11 61.91,114.3 61.91,102.55 v62.23,99.06 | U$2.DM1 26.67,8.89 26.67,16.51 27.94,17.78 29.84,22.86 39.05,22.86 42.86,26.67 49.53,26.67 55.88,33.02 v55.88,41.91 54.93,43.81 54.93,50.8 53.98,54.61 52.7,56.83 51.12,66.67 49.21,70.17 49.21,73.66 52.39,78.74 52.39,85.41 51.12,87.95 51.12,93.98 v46.99,102.87
  Bottom 0.406: E49.4 55.88,46.67 v55.88,41.91 | E62.5 13.02,110.17 15.24,102.23 16.19,101.6 17.78,101.6 22.86,99.06 27.62,97.47 32.07,97.47 33.02,98.42 33.02,99.06 33.97,100.33 41.27,100.33 v46.99,102.87 48.26,101.6 53.34,101.6 58.42,99.06 v62.23,99.06
!MD11  (via drill 0.81, 0.9)
  Top 0.406: U$2.DP1 20.32,8.89 20.32,15.24 21.59,16.51 25.4,16.51 26.67,17.78 28.89,24.13 39.05,24.13 42.86,27.94 49.53,27.94 54.61,33.02 54.61,39.69 53.34,43.5 v53.34,50.8 51.75,53.34 50.8,58.42 50.16,66.67 48.26,70.17 48.26,73.66 51.12,79.69 51.12,85.41 49.85,88.27 49.85,92.71 45.09,99.38 44.45,103.5 v45.72,105.41 43.18,109.22 43.18,114.3 40.96,116.52 40.96,122.56 36.51,125.41 36.2,144.15 38.1,147.32 38.1,153.03 35.56,155.57 35.56,163.51 39.05,166.69 39.05,172.4 E58.12